# EasyEDA Pro project ProPrj_supercap v0.1_2026-02-15.epro, board 4loko
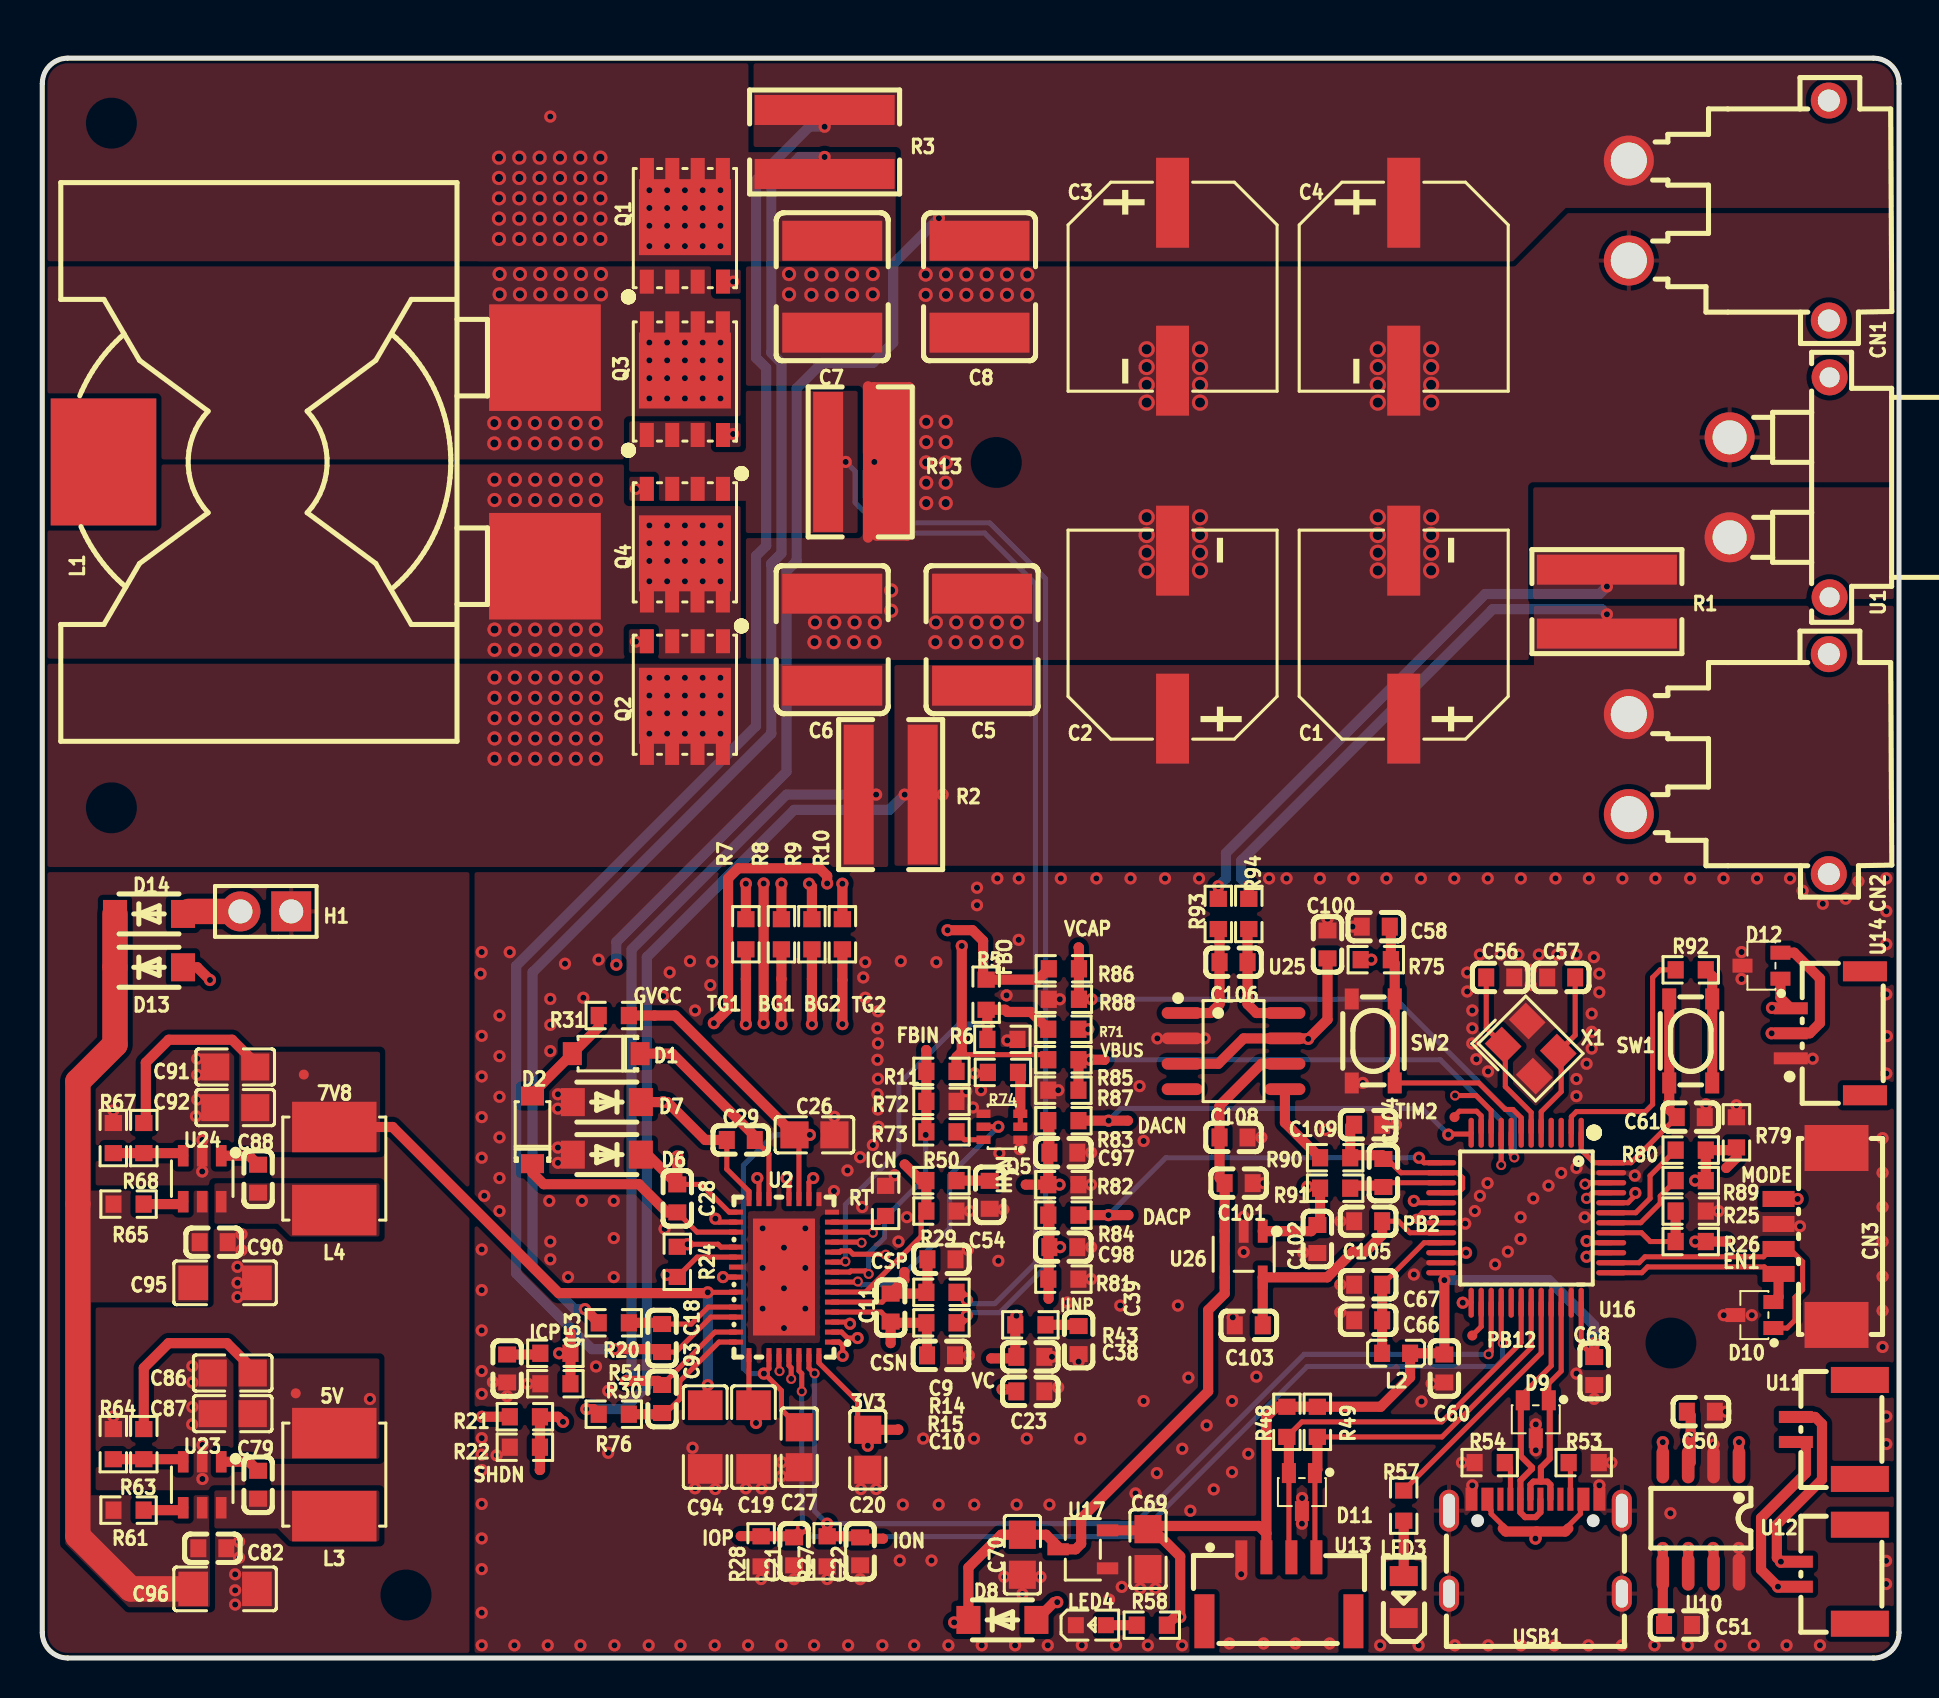
[diagram p5: board, top side]
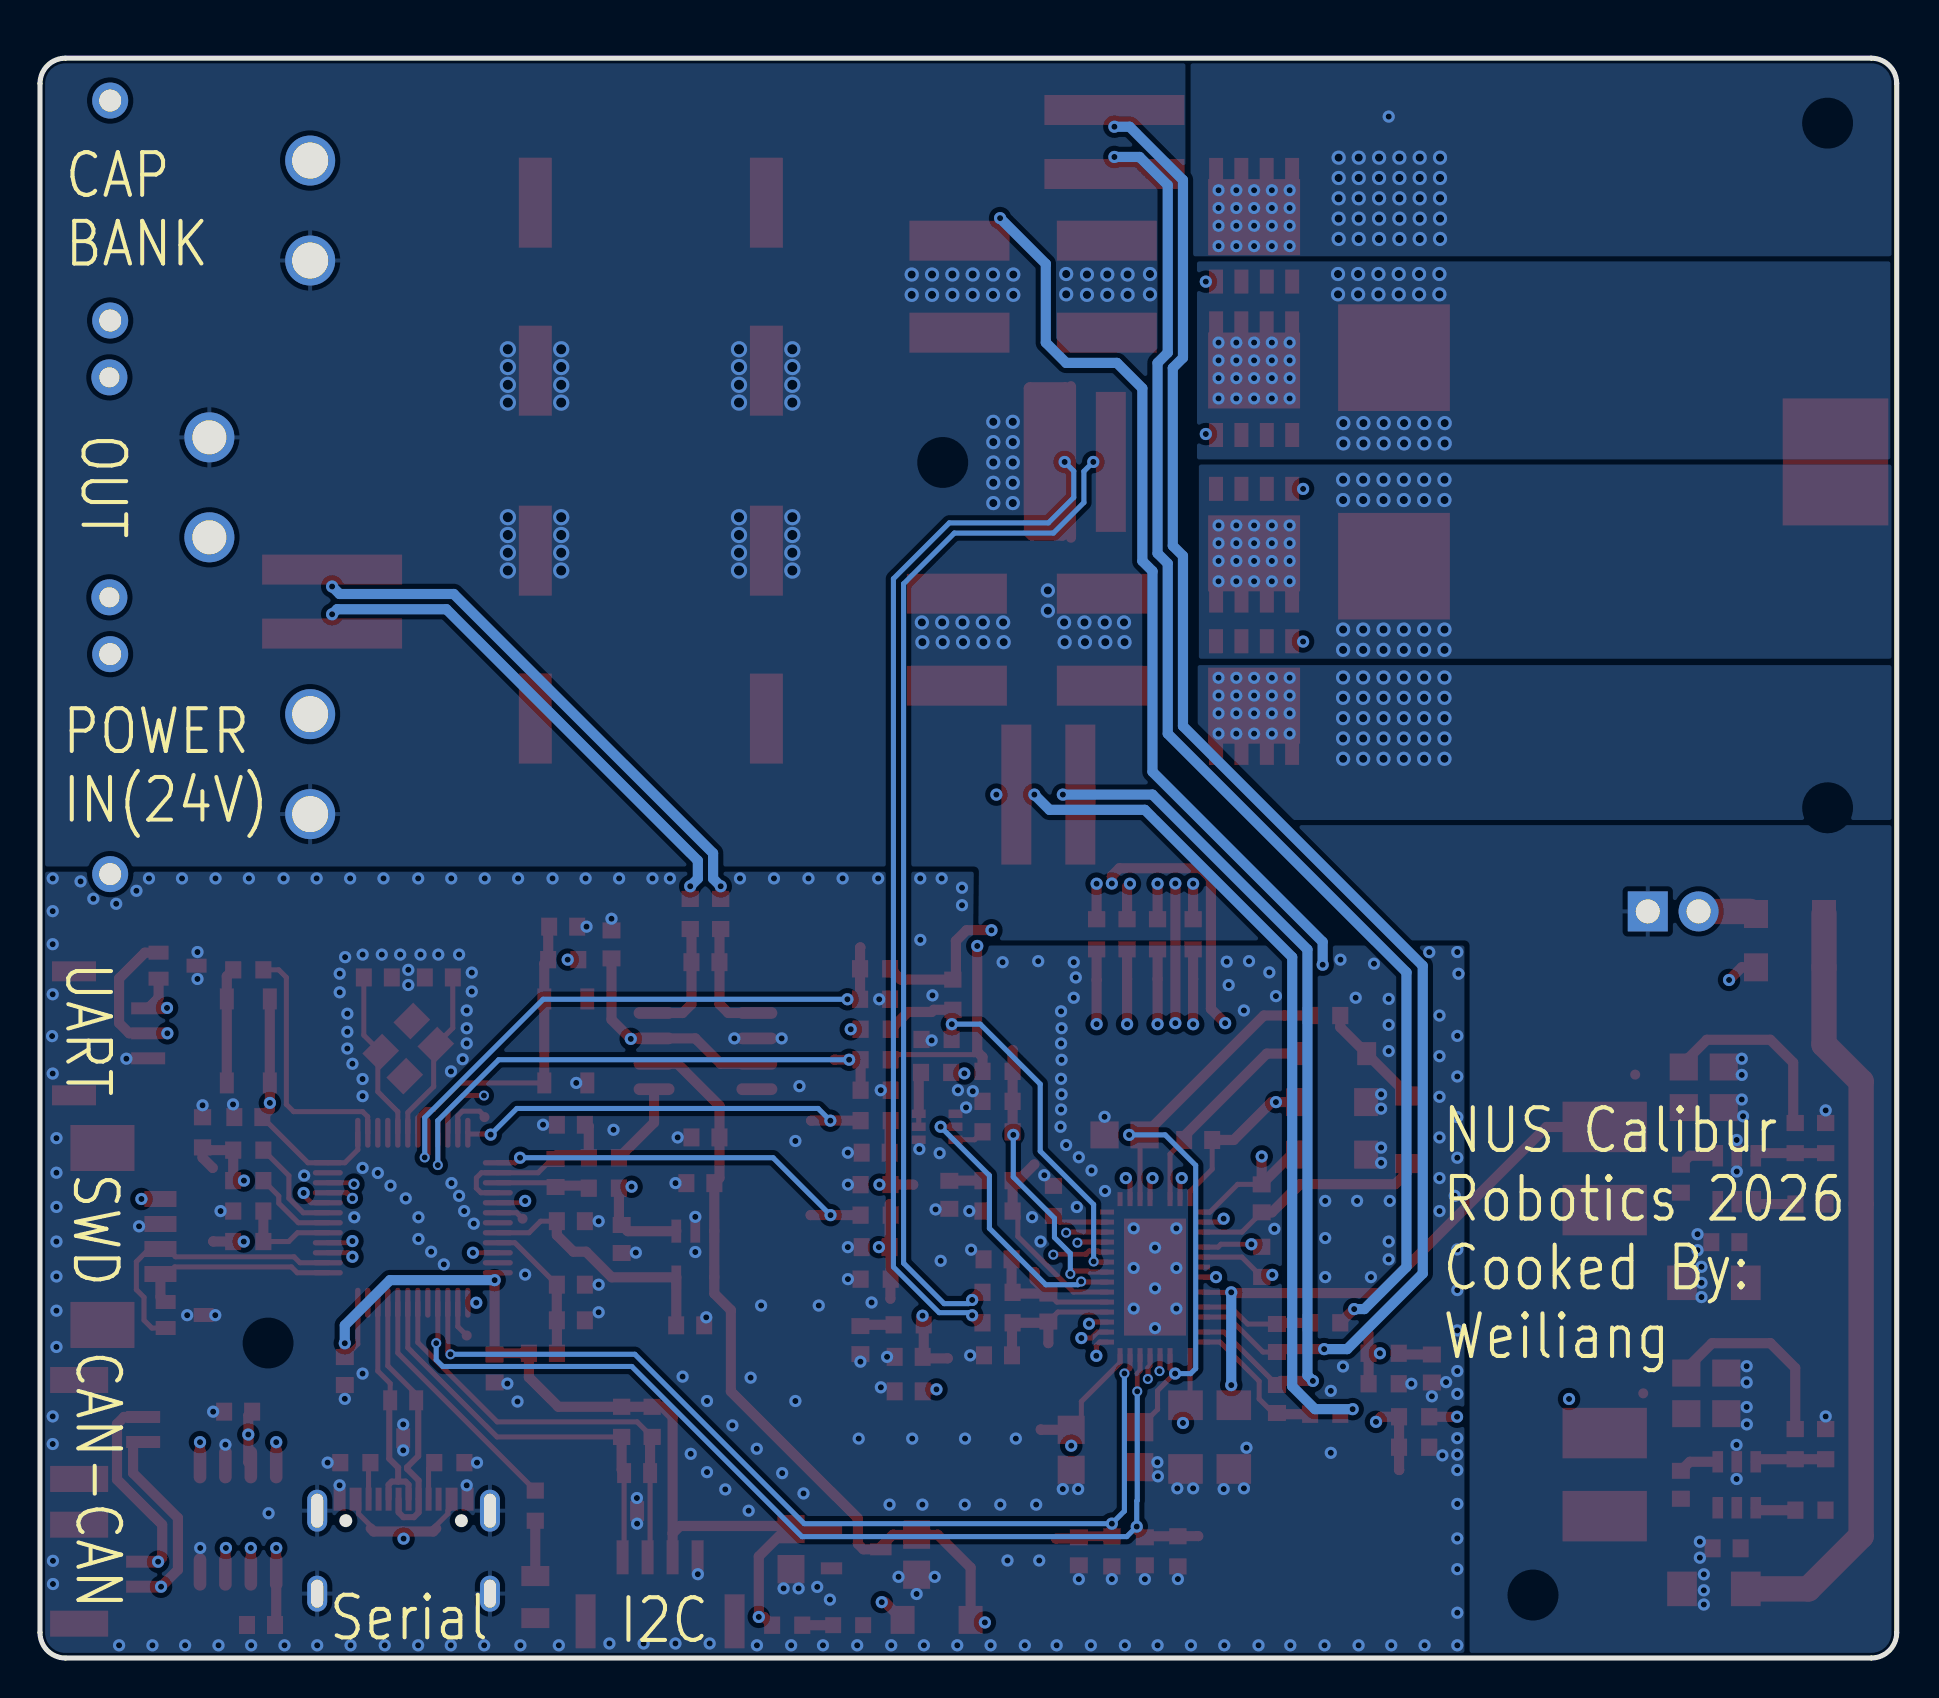
[diagram p6: board, bottom side, seen from below]

Outline 92.84 x 80.01 mm; copper layers: Top Layer, Inner1, Inner2, Bottom Layer. Coordinates in mm from the lower left corner of the outline.
Outline path: 0,78.74 0,1.27 arc(0.37,0.37) 1.27,0 91.57,0 arc(92.47,0.37) 92.84,1.27 92.84,78.74 arc(92.47,79.64) 91.57,80.01 1.27,80.01 arc(0.37,79.64) 0,78.74
Stack: Top Layer 0.035mm Outer layer thickness 1oz / Dielectric1 0.2104mm 7628 RC49% 8.6mil / Inner1 0.0152mm Inner layer thickness / Dielectric2 1.065mm 1.1mm H/HOZ Copper / Inner2 0.0152mm Inner layer thickness / Dielectric3 0.2104mm 7628 RC49% 8.6mil / Bottom Layer 0.035mm Outer layer thickness 1oz

## Design rules (mm)
template: Custom Config
spacing copperThickness1oz (default): track to track 0.102, other pairs 0.152 to 0.3
spacing copperThickness2oz: track to track 0.203, other pairs 0.152 to 0.3
track width copperThickness1oz (default): min 0.127, default 0.254, max 2.54
track width copperThickness2oz: min 0.203, default 0.254, max 2.54
differential pair differentialPair (default): width min 0.127, default 0.254, max 2.54; gap min 0.152, default 0.152
via viaSize (default): diameter min 0.5, default 0.61, max 10; hole min 0.3, default 0.305, max 6.3
net VBUSIN uses powerconnector
net GND uses ground
net CSNOUT uses powerconnector
net M4 uses directcopper
net AGND uses directcopper
net SW1 uses directcopper
net SW2 uses directcopper
net +5V uses directcopper
net $1N2593 uses directcopper
net $1N2600 uses directcopper
net $1N2588 uses directcopper
net MCSP uses directcopper
net $1N2584 uses directcopper
net VBUSOUT uses powerconnector
net CSNIN uses directcopper
net 7V8 uses directcopper
net $3N12371 uses directcopper
net $3N14015 uses directcopper
net VAUXIN uses directcopper

## Placement (name value [footprint] x y rotation side)
3V3  -  [Test-Point-0.5mm]  42.8 11.43 0 top
5V  -  [Test-Point-0.5mm]  12.67 13.24 270 top
7V8  -  [Test-Point-0.5mm]  13.08 29.18 270 top
BG1  -  [Test-Point-0.5mm]  36.96 33.96 0 top
BG2  -  [Test-Point-0.5mm]  38.48 33.96 0 top
C1  270uF  [CAP-SMD_BD10.0-L10.3-W10.3-LS11.6-FD]  68.07 51.18 90 top
C2  270uF  [CAP-SMD_BD10.0-L10.3-W10.3-LS11.6-FD]  56.51 51.18 90 top
C3  270uF  [CAP-SMD_BD10.0-L10.3-W10.3-LS11.6-FD]  56.51 68.58 270 top
C4  270uF  [CAP-SMD_BD10.0-L10.3-W10.3-LS11.6-FD]  68.07 68.58 270 top
C5  10uF  [CAP-SMD_L6.0-W5.0]  46.99 50.93 90 top
C6  10uF  [CAP-SMD_L6.0-W5.0]  39.5 50.93 90 top
C7  10uF  [CAP-SMD_L6.0-W5.0]  39.5 68.58 270 top
C8  10uF  [CAP-SMD_L6.0-W5.0]  46.86 68.58 270 top
C9  1nF  [C0603]  44.96 19.94 0 top
C10  1nF  [C0603]  44.94 15.14 180 top
C11  3.3nF  [C0603]  42.42 17.53 270 top
C18  470nF  [C0603]  30.99 16 270 top
C19  4.7uF  [C1206]  35.56 11.05 270 top
C20  4.7uF  [C0805]  41.28 10.41 90 top
C21  10nF  [C0603]  37.59 5.33 270 top
C22  10nF  [C0603]  40.89 5.33 270 top
C23  1uF  [C0603]  49.4 13.34 0 top
C26  4.7uF  [C0805]  38.61 26.16 180 top
C27  4.7uF  [C0805]  37.85 10.54 90 top
C28  220nF  [C0603]  31.75 22.99 270 top
C29  220nF  [C0603]  34.93 25.91 0 top
C38  220pF  [C0603]  49.4 15.06 0 top
C39  4.7nF  [C0603]  51.82 15.9 270 top
C50  100nF  [C0603]  82.93 12.32 180 top
C51  100nF  [C0603]  81.79 1.65 180 top
C53  10nF  [C0603]  23.24 14.48 270 top
C54  10nF  [C0603]  47.37 23.17 270 top
C56  10pF  [C0603]  72.9 34.04 0 top
C57  10pF  [C0603]  75.95 34.04 0 top
C58  100nF  [C0603]  66.68 36.58 0 top
C60  100nF  [C0603]  70.1 14.48 90 top
C61  100nF  [C0603]  82.42 27.05 180 top
C66  1uF  [C0603]  66.29 16.89 180 top
C67  100nF  [C0603]  66.29 18.67 0 top
C68  100nF  [C0603]  77.6 14.35 90 top
C69  4.7uF  [C0805]  55.29 5.44 90 top
C70  4.7uF  [C0805]  49.01 5.17 90 top
C79  100nF  [C0603]  10.79 8.66 90 top
C82  100nF  [C0603]  8.5 5.49 0 top
C86  4.7uF  [C0805]  9.52 14.25 0 top
C87  4.7uF  [C0805]  9.52 12.22 0 top
C88  100nF  [C0603]  10.79 23.97 90 top
C90  100nF  [C0603]  8.57 20.8 0 top
C91  4.7uF  [C0805]  9.65 29.56 0 top
C92  4.7uF  [C0805]  9.65 27.53 0 top
C93  470nF  [C0603]  30.99 12.95 90 top
C94  4.7uF  [C1206]  33.15 11.05 270 top
C95  4.7uF  [C1206]  9.14 18.76 0 top
C96  4.7uF  [C1206]  9.14 3.46 180 top
C97  10nF  [C0603]  51.05 25.27 0 top
C98  10nF  [C0603]  51.05 20.55 0 top
C100  100nF  [C0603]  64.26 35.69 90 top
C101  1uF  [C0603]  59.82 23.75 180 top
C102  100nF  [C0603]  63.75 20.96 270 top
C103  100nF  [C0603]  60.32 16.64 180 top
C104  220pF  [C0603]  67.06 24.26 270 top
C105  100nF  [C0603]  66.29 21.84 180 top
C106  220pF  [C0603]  59.56 34.8 0 top
C108  1uF  [C0603]  59.56 26.03 0 top
C109  220pF  [C0603]  66.29 26.67 0 top
CN1  XT30PW-M30.G.Y  [CONN-TH_XT30PW-M]  84.33 72.39 90 top
CN2  XT30PW-M30.G.Y  [CONN-TH_XT30PW-M]  84.33 44.7 90 top
CN3  532610471  [CONN-SMD_4P-P1.25_53261-0471]  88.26 21.08 90 top
CSN  -  [Test-Point-0.5mm]  42.42 15.75 0 top
CSP  -  [Test-Point-0.5mm]  43.1 19.3 0 top
D1  DSF1D  [SOD-123_L2.8-W1.8-LS3.7-RD]  28.19 30.23 180 top
D2  DSF1D  [SOD-123_L2.8-W1.8-LS3.7-RD]  24.51 26.42 90 top
D6  DSK110  [SOD-123_L2.8-W1.8-LS3.7-FD]  28.23 25.17 0 top
D7  DSK110  [SOD-123_L2.8-W1.8-LS3.7-FD]  28.23 27.8 0 top
D8  DSK110  [SOD-123_L2.8-W1.8-LS3.7-FD]  48.01 1.91 180 top
D9  TPD2E2U06DCKR  [SC-70-3_L2.0-W1.3-P0.65-LS2.1-BL]  74.68 11.94 180 top
D10  TPD2E2U06DCKR  [SC-70-3_L2.0-W1.3-P0.65-LS2.1-BL]  85.6 17.15 90 top
D11  TPD2E2U06DCKR  [SC-70-3_L2.0-W1.3-P0.65-LS2.1-BL]  62.98 8.3 180 top
D12  TPD2E2U06DCKR  [SC-70-3_L2.0-W1.3-P0.65-LS2.1-BL]  85.96 34.62 90 top
D13  DSK110  [SOD-123_L2.8-W1.8-LS3.7-FD]  5.33 34.54 180 top
D14  DSK110  [SOD-123_L2.8-W1.8-LS3.7-FD]  5.33 37.21 180 top
DACN  -  [Test-Point-0.5mm]  54.28 26.87 0 top
DACP  -  [Test-Point-0.5mm]  54.31 22.15 0 top
EN1  -  [Test-Point-0.5mm]  84.18 20.84 0 top
FBIN  -  [Test-Point-0.5mm]  44.2 30.4 0 top
FBO  -  [Test-Point-0.5mm]  48.26 32.31 90 top
GVCC  -  [Test-Point-0.5mm]  30.61 32.13 0 top
H1  PZ254V-11-02P  [HDR-TH_2P-P2.54-V-M]  11.18 37.34 180 top
ICN  -  [Test-Point-0.5mm]  43.12 24.68 0 top
ICP  -  [Test-Point-0.5mm]  26.42 16.26 0 top
IINN  -  [Test-Point-0.5mm]  49.17 23.67 0 top
IINP  -  [Test-Point-0.5mm]  50.31 17.97 0 top
ION  -  [Test-Point-0.5mm]  42.04 5.97 270 top
IOP  -  [Test-Point-0.5mm]  34.93 6.1 270 top
L1  6.8uH  [IND-SMD_3P-L27.9-W19.7-P10.43-LS27.9-BL-A]  14.1 59.82 90 top
L2  BLM18AG102SN1D  [L0603]  67.69 15.24 180 top
L3  22uH  [IND-SMD_L5.0-W5.0_LVS505040]  14.6 9.17 270 top
L4  22uH  [IND-SMD_L5.0-W5.0_LVS505040]  14.6 24.48 270 top
LED3  KT-0805B  [LED0805-R-RD]  68.07 3.05 90 top
LED4  KT-0603R  [LED0603-RD]  52.43 1.64 0 top
MODE  -  [Test-Point-0.5mm]  84.2 24.51 0 top
PB2  -  [Test-Point-0.5mm]  68.71 21.97 0 top
PB12  -  [Test-Point-0.5mm]  71.5 16.13 0 top
Q1  CJAC13TH06  [PDFN-8_L5.8-W4.9-P1.27-LS6.1-BL]  32.13 71.63 0 top
Q2  CJAC13TH06  [PDFN-8_L5.8-W4.9-P1.27-LS6.1-BL]  32.13 48.06 180 top
Q3  CJAC13TH06  [PDFN-8_L5.8-W4.9-P1.27-LS6.1-BL]  32.13 63.96 0 top
Q4  CJAC13TH06  [PDFN-8_L5.8-W4.9-P1.27-LS6.1-BL]  32.13 55.68 180 top
Q5  2N7002DW-7-F  [SOT-363_L2.0-W1.3-P0.65-LS2.1-TL]  47.98 26.57 180 top
R1  2mΩ  [R1225]  78.23 52.83 90 top
R2  2mΩ  [R1225]  42.42 43.18 0 top
R3  2mΩ  [R1225]  39.12 75.82 270 top
R5  137kΩ  [R0603]  47.19 33.17 270 top
R6  7.68kΩ  [R0603]  48.01 30.94 0 top
R7  1Ω  [R0603]  35.18 36.19 270 top
R8  1Ω  [R0603]  36.96 36.19 270 top
R9  1Ω  [R0603]  38.48 36.19 270 top
R10  1Ω  [R0603]  40 36.19 270 top
R11  137kΩ  [R0603]  44.96 29.34 180 top
R13  2mΩ  [R1225]  40.89 59.82 180 top
R14  10Ω  [R0603]  44.96 18.29 180 top
R15  10Ω  [R0603]  44.96 16.76 180 top
R20  10Ω  [R0603]  28.57 16.76 0 top
R21  665kΩ  [R0603]  24.13 12.06 0 top
R22  100kΩ  [R0603]  24.13 10.54 180 top
R24  100kΩ  [R0603]  31.75 19.81 90 top
R25  56kΩ  [R0603]  82.42 22.35 180 top
R26  56kΩ  [R0603]  82.42 20.83 0 top
R27  24.3kΩ  [R0603]  39.24 5.33 270 top
R28  24.3kΩ  [R0603]  35.94 5.33 270 top
R29  17.4kΩ  [R0603]  44.96 22.35 0 top
R30  17.4kΩ  [R0603]  25.65 13.72 180 top
R31  3.3Ω  [R0603]  28.57 32.13 180 top
R43  21kΩ  [R0603]  49.4 16.66 0 top
R48  7.68kΩ  [R0603]  62.23 11.81 270 top
R49  7.68kΩ  [R0603]  63.75 11.81 270 top
R50  200Ω  [R0603]  44.96 23.88 0 top
R51  200Ω  [R0603]  25.65 15.24 180 top
R53  5.1kΩ  [R0603]  77.07 9.77 180 top
R54  5.1kΩ  [R0603]  72.37 9.77 0 top
R57  5.1kΩ  [R0603]  68.07 7.62 90 top
R58  5.1kΩ  [R0603]  55.48 1.64 0 top
R61  665kΩ  [R0603]  4.31 7.39 180 top
R63  56kΩ  [R0603]  5.07 10.7 90 top
R64  10.7kΩ  [R0603]  3.55 10.7 270 top
R65  665kΩ  [R0603]  4.31 22.7 180 top
R67  10.7kΩ  [R0603]  3.55 26 270 top
R68  93.1kΩ  [R0603]  5.07 26 90 top
R71  17.4kΩ  [R0603]  51.05 31.44 0 top
R72  17.4kΩ  [R0603]  44.96 27.84 0 top
R73  10.7kΩ  [R0603]  44.96 26.31 180 top
R74  100kΩ  [R0603]  48.03 29.29 0 top
R75  10.7kΩ  [R0603]  66.68 34.92 180 top
R76  10Ω  [R0603]  28.57 12.19 0 top
R79  93.1kΩ  [R0603]  84.71 26.29 270 top
R80  56kΩ  [R0603]  82.42 25.4 0 top
R81  30.1kΩ  [R0603]  51.05 18.95 180 top
R82  30.1kΩ  [R0603]  51.05 23.67 180 top
R83  50kΩ  [R0603]  51.05 26.87 180 top
R84  50kΩ  [R0603]  51.05 22.15 0 top
R85  56kΩ  [R0603]  51.05 29.92 180 top
R86  56kΩ  [R0603]  51.08 34.47 180 top
R87  5.1kΩ  [R0603]  51.05 28.4 0 top
R88  5.1kΩ  [R0603]  51.08 32.94 0 top
R89  30.1kΩ  [R0603]  82.42 23.88 180 top
R90  200Ω  [R0603]  64.64 25.02 0 top
R91  200Ω  [R0603]  64.64 23.5 0 top
R92  200Ω  [R0603]  82.42 34.42 180 top
R93  1Ω  [R0603]  58.8 37.21 270 top
R94  1Ω  [R0603]  60.32 37.21 270 top
RT  294kΩ  [R0603]  42.16 22.86 90 top
SHDN  -  [Test-Point-0.5mm]  24.87 9.4 0 top
SW1  SKRPACE010  [KEY-SMD_4P-L4.2-W3.2-P2.20-LS4.6]  82.42 30.86 90 top
SW2  SKRPACE010  [KEY-SMD_4P-L4.2-W3.2-P2.20-LS4.6]  66.55 30.86 90 top
TG1  -  [Test-Point-0.5mm]  35.18 33.96 0 top
TG2  -  [Test-Point-0.5mm]  40 33.91 0 top
TIM2  -  [Test-Point-0.5mm]  70.61 27.05 0 top
U1  XT30PW-F20.G.Y  [CONN-TH_XT30PW-F-1]  86.87 58.55 90 top
U2  LT8708EUHG#TRPBF  [QFN-40_L8.0-W5.0-P0.50-TL-EP_ADI_UHG]  37.08 19.05 180 top
U10  ATA6560-GAQW-N  [SOP-8_L4.9-W3.9-P1.27-LS6.0-BL]  82.93 6.99 180 top
U11  SM02B-GHS-TB(LF)(SN)  [CONN-SMD_SM02B-GHS-TB-LF-SN]  89.28 11.43 90 top
U12  SM02B-GHS-TB(LF)(SN)  [CONN-SMD_SM02B-GHS-TB-LF-SN]  89.28 4.19 90 top
U13  SM04B-GHS-TB(LF)(SN)  [CONN-SMD_4P-P1.25_SM04B-GHS-TB-LF-SN]  61.83 3.44 0 top
U14  SM03B-GHS-TB(LF)(SN)  [CONN-TH_SM03B-GHS-TB-LF-SN]  89.28 31.24 90 top
U16  STM32G431CBT6  [LQFP-48_L7.0-W7.0-P0.50-LS9.0-BL]  74.2 22.02 180 top
U17  ME6216A33XG  [SOT-23-3_L2.9-W1.6-P1.90-LS2.8-BR]  52.03 5.44 0 top
U23  LGS5148  [SOT-23-6_L2.9-W1.6-P0.95-LS2.8-BL]  8 8.66 180 top
U24  LGS5148  [SOT-23-6_L2.9-W1.6-P0.95-LS2.8-BL]  8 23.97 180 top
U25  INA240A2DR  [SOIC-8_L4.9-W3.9-P1.27-LS6.0-BL]  59.56 30.35 270 top
U26  REF2033AIDDCR  [SOT-23-5_L3.0-W1.7-P0.95-LS2.8-BL]  60.07 20.19 180 top
USB1  TYPE-C16PIN  [USB-C-SMD_TYPE-C16PIN]  74.66 5.58 0 top
VBUS  -  [Test-Point-0.5mm]  53.11 29.92 0 top
VC  -  [Test-Point-0.5mm]  47.45 14.99 0 top
VCAP  -  [Test-Point-0.5mm]  51.82 35.54 0 top
X1  8MHz  [CRYSTAL-SMD_4P-L3.2-W2.5-BL]  74.42 30.48 315 top

## Footprints (pads in the part's own frame, mm; a bottom-side part is the same pattern mirrored in y, then rotated)
C0603
  rect 0.8x0.9 smd: 1(-0.7,0) 2(0.7,0)
C0805
  rect 1.41x1.35 smd: 1(-1,0) 2(1,0)
C1206
  rect 1.485x1.728 smd: 1(-1.593,0) 2(1.593,0)
CAP-SMD_BD10.0-L10.3-W10.3-LS11.6-FD
  rect 4.5x1.65 smd: 1(-4.2,0) 2(4.2,0)
CAP-SMD_L6.0-W5.0
  rect 2x5 smd: 1(-2.3,0) 2(2.3,0)
CONN-SMD_4P-P1.25_53261-0471
  rect 0.8x1.6 smd: 1(-1.875,1.45) 2(-0.625,1.45) 3(0.625,1.45) 4(1.875,1.45)
  rect 2.3x3.2 smd: 5(4.425,-1.45) 6(-4.425,-1.45)
CONN-SMD_4P-P1.25_SM04B-GHS-TB-LF-SN
  rect 0.6x1.7 smd: 1(-1.875,1.599) 2(-0.625,1.599) 3(0.625,1.599) 4(1.875,1.599)
  rect 1x2.7 smd: 5(3.724,-1.599) 6(-3.724,-1.599)
CONN-SMD_SM02B-GHS-TB-LF-SN
  rect 0.6x1.7 smd: 1(-0.625,1.6) 2(0.625,1.6)
  rect 1.3x2.9 smd: 3(2.475,-1.6) 4(-2.475,-1.6)
CONN-TH_SM03B-GHS-TB-LF-SN
  rect 0.6x1.7 smd: 1(-1.25,1.854) 2(0,1.854) 3(1.25,1.854)
  rect 1x2.2 smd: 4(3.1,-1.854) 5(-3.1,-1.854)
CONN-TH_XT30PW-F-1
  round 2.5 hole 1.7: 1(-2.5,2.5) 2(2.5,2.5)
  round 1.8 hole 1: 3(5.5,-2.5) 4(-5.5,-2.5)
CONN-TH_XT30PW-M
  round 2.5 hole 1.8: 1(-2.5,5) 2(2.5,5)
  round 1.8 hole 1.1: 3(5.5,-5) 4(-5.5,-5)
CRYSTAL-SMD_4P-L3.2-W2.5-BL
  rect 1.4x1.2 smd: 1(-1.1,-0.85) 2(1.1,-0.85) 3(1.1,0.85) 4(-1.1,0.85)
HDR-TH_2P-P2.54-V-M
  rect 2x2 hole 1.2: 1(-1.27,0)
  round 2 hole 1.2: 2(1.27,0)
IND-SMD_3P-L27.9-W19.7-P10.43-LS27.9-BL-A
  rect 5.33x5.59 smd: 1(-5.215,-11.037) 2(5.215,-11.037)
  rect 6.35x5.28 smd: 3(0,11.037)
IND-SMD_L5.0-W5.0_LVS505040
  rect 2.524x4.22 smd: 1(2.078,0) 2(-2.078,0)
KEY-SMD_4P-L4.2-W3.2-P2.20-LS4.6
  rect 1.05x0.7 smd: 1(-2.1,1.075) 2(2.1,1.075) 3(-2.1,-1.075) 4(2.1,-1.075)
L0603
  rect 0.8x0.864 smd: 1(-0.7,0) 2(0.7,0)
LED0603-RD
  rect 0.8x0.8 smd: 1(-0.749,0) 2(0.749,0)
LED0805-R-RD
  rect 1x1.399 smd: 1(1.05,0) 2(-1.05,0)
LQFP-48_L7.0-W7.0-P0.50-LS9.0-BL
  oval 0.27x1.5 smd: 1(-2.75,-4.25) 2(-2.25,-4.25) 3(-1.75,-4.25) 4(-1.25,-4.25) 5(-0.75,-4.25) 6(-0.25,-4.25) 7(0.25,-4.25) 8(0.75,-4.25) 9(1.25,-4.25) 10(1.75,-4.25) 11(2.25,-4.25) 12(2.75,-4.25) 25(2.75,4.25) 26(2.25,4.25) 27(1.75,4.25) 28(1.25,4.25) 29(0.75,4.25) 30(0.25,4.25) 31(-0.25,4.25) 32(-0.75,4.25) 33(-1.25,4.25) 34(-1.75,4.25) 35(-2.25,4.25) 36(-2.75,4.25)
  oval 1.5x0.27 smd: 13(4.25,-2.75) 14(4.25,-2.25) 15(4.25,-1.75) 16(4.25,-1.25) 17(4.25,-0.75) 18(4.25,-0.25) 19(4.25,0.25) 20(4.25,0.75) 21(4.25,1.25) 22(4.25,1.75) 23(4.25,2.25) 24(4.25,2.75) 37(-4.25,2.75) 38(-4.25,2.25) 39(-4.25,1.75) 40(-4.25,1.25) 41(-4.25,0.75) 42(-4.25,0.25) 43(-4.25,-0.25) 44(-4.25,-0.75) 45(-4.25,-1.25) 46(-4.25,-1.75) 47(-4.25,-2.25) 48(-4.25,-2.75)
PDFN-8_L5.8-W4.9-P1.27-LS6.1-BL
  rect 0.7x1.2 smd: 1(-1.905,-2.792) 2(-0.635,-2.792) 3(0.635,-2.792) 4(1.905,-2.792) 5(1.9,2.792) 6(0.64,2.792) 7(-0.63,2.792) 8(-1.9,2.792)
  rect 4.6x3.8 smd: 9(0,0.432)
QFN-40_L8.0-W5.0-P0.50-TL-EP_ADI_UHG
  rect 0.7x0.25 smd: 1(-2.4,3.25) 2(-2.4,2.75) 3(-2.4,2.25) 4(-2.4,1.75) 5(-2.4,1.25) 6(-2.4,0.75) 7(-2.4,0.25) 8(-2.4,-0.25) 9(-2.4,-0.75) 10(-2.4,-1.25) 11(-2.4,-1.75) 12(-2.4,-2.25) 13(-2.4,-2.75) 14(-2.4,-3.25) 22(2.4,-3.25) 23(2.4,-2.75) 24(2.4,-2.25) 25(2.4,-1.5) 26(2.4,-1) 27(2.4,-0.5) 28(2.4,0) 29(2.4,0.75) 30(2.4,1.5) 31(2.4,2) 32(2.4,2.75) 33(2.4,3.25)
  rect 0.25x0.7 smd: 15(-1.75,-3.9) 16(-1.25,-3.9) 17(-0.75,-3.9) 18(-0.25,-3.9) 19(0.75,-3.9) 20(1.25,-3.9) 21(1.75,-3.9) 34(1.75,3.9) 35(0.75,3.9) 36(0.25,3.9) 37(-0.25,3.9) 38(-0.75,3.9) 39(-1.25,3.9) 40(-1.75,3.9)
  rect 3.1x5.85 smd: 41(0,0)
R0603
  rect 0.806x0.864 smd: 1(-0.753,0) 2(0.753,0)
R1225
  rect 1.5x7 smd: 1(-1.6,0) 2(1.6,0)
SC-70-3_L2.0-W1.3-P0.65-LS2.1-BL
  rect 0.7x1 smd: 1(-0.65,-0.95) 2(0.65,-0.95) 3(0,0.95)
SOD-123_L2.8-W1.8-LS3.7-FD
  rect 1.2x1.4 smd: 1(-1.7,0) 2(1.7,0)
SOD-123_L2.8-W1.8-LS3.7-RD
  rect 0.95x1.15 smd: 1(-1.692,0) 2(1.692,0)
SOIC-8_L4.9-W3.9-P1.27-LS6.0-BL
  oval 0.588x2.045 smd: 1(-1.905,-2.57) 2(-0.635,-2.57) 3(0.635,-2.57) 4(1.905,-2.57) 5(1.905,2.57) 6(0.635,2.57) 7(-0.635,2.57) 8(-1.905,2.57)
SOP-8_L4.9-W3.9-P1.27-LS6.0-BL
  oval 0.63x1.865 smd: 1(-1.905,-2.683) 2(-0.635,-2.683) 3(0.635,-2.683) 4(1.905,-2.683) 5(1.905,2.683) 6(0.635,2.683) 7(-0.635,2.683) 8(-1.905,2.683)
SOT-23-3_L2.9-W1.6-P1.90-LS2.8-BR
  rect 1.07x0.6 smd: 1(1.235,-0.95) 2(1.235,0.95) 3(-1.235,0)
SOT-23-5_L3.0-W1.7-P0.95-LS2.8-BL
  rect 0.49x1.157 smd: 1(-0.95,-1.153) 2(0,-1.153) 3(0.95,-1.153)
  rect 0.49x1.175 smd: 4(0.95,1.153) 5(-0.95,1.153)
SOT-23-6_L2.9-W1.6-P0.95-LS2.8-BL
  rect 0.532x1.072 smd: 1(-0.95,-1.149) 2(0,-1.149) 3(0.95,-1.149) 4(0.95,1.149) 5(0,1.149) 6(-0.95,1.149)
SOT-363_L2.0-W1.3-P0.65-LS2.1-TL
  rect 0.7x0.42 smd: 1(-0.92,0.65) 2(-0.92,0) 3(-0.92,-0.65) 4(0.92,-0.65) 5(0.92,0) 6(0.92,0.65)
Test-Point-0.5mm
  round 0.5 smd: 1(0,0)
USB-C-SMD_TYPE-C16PIN
  oval 1x2.1 hole 0.6x1.7: 1(-4.32,1.788) 2(4.32,1.788)
  oval 1x1.8 hole 0.6x1.4: 3(-4.32,-2.362) 4(4.32,-2.362)
  rect 0.6x1.15 smd: A1B12(-3.2,2.362) A4B9(-2.4,2.362) B1A12(3.2,2.362) B4A9(2.4,2.362)
  rect 0.3x1.15 smd: A5(-1.25,2.362) A6(-0.25,2.362) A7(0.25,2.362) A8(1.25,2.362) B5(1.75,2.362) B6(0.75,2.362) B7(-0.75,2.362) B8(-1.75,2.362)

## Nets
As in the schematic.

Pads without a net: CN1 3 4; CN2 3 4; L1 3; U1 3 4; U11 3 4; U12 3 4; U13 5 6; U14 4 5; U16 3 4; U25 4; USB1 A8 B8

## Via types
v1: diameter 0.61, hole 0.305, Top Layer to Bottom Layer, 538 vias
v2: diameter 0.711, hole 0.406, Top Layer to Bottom Layer, 160 vias
v3: diameter 0.813, hole 0.508, Top Layer to Bottom Layer, 32 vias
v4: diameter 0.5, hole 0.299, Top Layer to Bottom Layer, 15 vias
v5: diameter 0.559, hole 0.305, Top Layer to Bottom Layer, 2 vias

## Routing (per net, layer and track width the routed paths; a pad name or vN(x,y) marks a point on that pad's centre or on a via; arc(x,y) is an arc through that point)
1V65: length 23.4
  Top Layer w0.508: U26.1 63.45,21.35 C102.1 63.89,21.79 R91.1 ; C100.1 64.26,31.93 v1(63.3,30.96) 63.27,30.99 U25.7 60.07,30.99 58.8,29.72 U25.3
  Inner2 w0.508: v1(63.3,30.96) 63.3,23.61 v1(63.26,23.57)
3V3: length 43
  Top Layer w0.254: U2.40 38.83,14.76 40.77,12.83 40.77,11.92 C20.2 ; R24.1 32.74,20.05 U2.26
  Top Layer w0.508: 3V3.1 42.78,11.41 C20.2 v1(41.28,10.62) ; R24.1 31.65,19.16 v1(31.22,19.16)
  Inner2 w0.254: v1(41.28,10.62) 40.72,11.18 38.1,11.18 34.54,14.73 33.27,14.73 29.72,11.18 25.53,11.18 25.15,11.56 25.15,17.15 26.29,18.29 30.35,18.29 v1(31.22,19.16)
3V3D: length 193.4
  Top Layer w0.254: C61.2 79.44,24.77 U16.48 77.59,24.77 76.95,25.42 U16.1 ; U16.24 70.1,19.11 v1(70.1,18.9) ; C68.2 76.95,15.7 U16.36
  Top Layer w0.508: U13.2 61.21,6.23 ; 61.21,6.23 61.21,12.06 61.71,12.56 R48.1 R49.1 66.92,12.56 68.39,14.03 L2.1 70.04,15.24 C60.2 v1(70.1,18.9) ; 61.21,6.23 60.83,6.6 55.45,6.6 C69.2 ; 81.35,27.76 SW1.2 ; v1(81.34,27.76) 81.34,27.43 C61.2 ; v1(77.6,15.74) C68.2 ; v1(87.77,22.96) CN3.4 ; C69.2 55.23,6.39 U17.2 ; C69.2 55.53,6.44 56.9,5.08 v1(56.9,2.05) 56.64,2.05 R58.2 ; v1(66.45,34.92) R75.2
  Inner2 w0.254: v1(66.45,34.92) 48.13,34.92 46.62,33.41 v1(46.62,29.23)
  Inner2 w0.508: 81.29,36.7 81.34,36.65 v1(81.34,27.76) ; 81.29,36.7 89.53,36.7 90.93,35.31 90.93,22.91 ; 81.29,36.7 68.23,36.7 v1(66.45,34.92) ; 90.93,22.91 90.93,3.18 89.3,1.55 57.4,1.55 v1(56.9,2.05) ; 90.93,22.91 90.89,22.96 v1(87.77,22.96)
  Bottom Layer w0.508: v1(77.6,15.74) 77.6,16.64 75.34,18.9 v1(70.1,18.9)
3V3REF: length 13.1
  Top Layer w0.254: C105.1 67.81,21.84 68.38,21.27 U16.20
  Top Layer w0.508: C103.1 61.02,16.64 U26.5 64.25,19.04 65.53,20.32 66.16,20.32 66.99,21.15 C105.1
7V8: length 38.9
  Top Layer w0.254: C94.1 33.15,13.52 v1(33.27,13.65) ; v1(33.27,18.29) 34.67,18.29 U2.29
  Top Layer w0.508: C91.2 10.65,29.77 9.49,30.92 6.32,30.92 5.18,29.78 5.18,26.86 R68.2 ; L4.2 17.51,26.56 25.82,18.25 33.24,18.25 v1(33.27,18.29)
  Bottom Layer w0.508: v1(33.27,18.29) v1(33.27,13.65)
+5V: length 145.8
  Top Layer w0.508: 50.79,5.56 50.19,6.17 C70.2 47.95,6.17 46.31,4.52 D8.2 46.18,1.78 v1(45.59,1.78) ; C50.2 82.42,12.13 v1(82.42,11.18) 82.42,9.79 U10.3 ; U17.3 51.66,5.44 51.94,5.72 51.94,6.99 58.29,13.34 58.29,17.4 59.12,18.23 U26.4 U26.3 59.12,23.75 58.86,24 C108.1 58.86,27.62 60.96,29.72 U25.6 ; C86.2 10.52,14.46 9.23,15.75 6.31,15.75 5.07,14.51 R63.2
  Inner2 w0.508: v1(82.42,11.18) 82.42,8 83.44,6.99 86.36,6.99 88.01,5.33 88.01,3.3 87.5,2.79 82.3,2.79 80.01,5.08 54.23,5.08 50.93,1.78 v1(45.59,1.78) 23.5,1.78 21.08,4.19 21.08,10.03 18.16,12.95 v1(16.38,12.95)
AGND:
  vias: v1(21.91,34.22) v1(21.97,35.31) v1(21.97,31.11) v1(21.97,29.08) v1(21.97,27.05) v1(21.97,25.02) v1(21.97,20.43) v1(21.97,18.4) v1(21.97,16.38) v1(21.97,14.35) v1(21.97,13.21) v1(21.97,11) v1(21.97,10.17) v1(21.97,9.4) v1(21.97,7.71) v1(21.97,5.98) v1(21.97,4.44) v1(21.97,2.26) v1(21.97,0.63) v1(22.1,23.11) v1(22.53,13.8) v1(22.72,10.13) v1(22.86,32.13) v1(22.86,30.1) v1(22.86,28.07) v1(22.86,26.03) v1(22.86,24) v1(22.86,22.35) v1(23.24,13.09) v1(23.37,35.3) v1(23.61,0.63) v1(24.27,13.72) v1(25.35,22.86) v1(25.27,0.63) v1(25.4,32.96) v1(25.4,31.66) v1(25.4,30.35) v1(25.4,20.83) v1(25.4,19.94) v1(25.78,28.19) v1(25.78,27.47) v1(25.78,25.53) v1(25.78,24.76) v1(26.14,34.72) v1(26.29,19.05) v1(26.91,0.63) v1(26.98,22.86) v1(27.05,33.02) v1(27.69,14.58) v1(27.81,34.92) v1(28.3,13.36) v1(28.3,10.26) v1(28.57,22.86) v1(28.57,21) v1(28.57,19.05) v1(28.61,0.63) v1(30.32,0.63) v1(31.04,33.1) v1(31.12,21.46) v1(31.37,34.29) v1(31.91,0.63) v1(32.38,34.85) v1(32.51,10.52) v1(32.64,32.39) v1(32.64,8.49) v1(33.4,33.66) v1(33.5,34.82) v1(33.62,0.63) v1(33.65,8.45) v1(35.18,8.49) v1(35.29,0.63) v1(35.94,3.95) v1(36.02,21.49) v1(36.02,19.51) v1(36.02,17.47) v1(35.97,8.49) v1(36.94,9.09) v1(36.97,9.79) v1(36.96,0.63) v1(37.08,20.52) v1(37.08,18.49) v1(37.08,16.5) v1(37.59,3.94) v1(38.15,21.49) v1(38.15,19.51) v1(38.15,17.47) v1(38.59,0.63) v1(39.24,3.95) v1(39.61,27.07) v1(39.58,23.36) v1(40.26,24.38) v1(40.29,0.63) v1(40.89,25.04) v1(40.93,8.45) v1(40.89,3.94) v1(41.05,34.04) v1(41,22.56) v1(41.15,34.8) v1(41.15,33.02) v1(41.53,25.65) v1(41.69,8.45) v1(41.78,32.34) v1(41.76,31.5) v1(41.78,30.73) v1(41.76,29.92) v1(41.78,28.97) v1(41.76,28.19) v1(41.78,27.43) v1(41.81,26.57) v1(42,0.63) v1(42.62,24.14) v1(42.81,20.83) v1(42.93,34.85) v1(42.88,4.88) v1(43.03,7.67) v1(43.23,22.05) v1(43.59,0.63) v1(44.04,10.97) v1(44.46,4.88) v1(44.7,34.8) v1(44.82,7.67) v1(45.31,0.63) v1(46.2,28.35) v1(46.28,20.42) v1(46.33,15.13) v1(46.37,22.35) v1(46.53,27.53) v1(46.58,10.97) v1(46.6,7.67) v1(46.74,38.52) v1(46.74,37.65) v1(46.94,28.4) v1(46.97,0.63) v1(47.75,38.99) v1(47.8,19.86) v1(47.85,25.25) v1(48.06,22.44) v1(48.1,4.06) v1(48.21,33.14) v1(48.25,30.89) v1(48.64,0.63) v1(48.72,7.67) v1(48.82,38.99) v1(48.82,35.92) v1(48.87,25.45) v1(49.01,3.2) v1(49.22,10.97) v1(49.91,4.06) v1(50.28,0.63) v1(50.36,7.67) v1(50.48,15.06) v1(50.8,28.4) v1(50.79,13.54) v1(50.93,38.99) v1(50.88,32.94) v1(51.26,17.78) v1(51.82,14.82) v1(51.9,10.97) v1(51.98,0.63) v1(52.44,25.27) v1(52.44,23.67) v1(52.44,20.55) v1(52.44,18.95) v1(52.71,38.99) v1(53.34,2.92) v1(53.69,0.63) v1(53.9,17.63) v1(53.97,3.56) v1(54.41,38.99) v1(54.66,8.23) v1(54.86,28.6) v1(54.91,3.48) v1(55.07,25.86) v1(55.07,12.85) v1(55.28,0.63) v1(55.73,9.25) v1(55.66,3.48) v1(55.75,30.99) v1(56.14,38.99) v1(56.78,17.63) v1(57,10.47) v1(56.99,0.63) v1(57.31,14.02) v1(57.4,7.37) v1(57.84,38.99) v1(58.12,30.99) v1(58.22,11.63) v1(58.57,8.43) v1(59.35,0.73) v1(59.53,17.04) v1(59.49,12.85) v1(59.49,9.3) v1(59.94,4.19) v1(60.07,22.06) v1(60.07,20.3) v1(60.3,10.21) v1(60.71,14.07) v1(60.95,26.03) v1(61.06,23.75) v1(61.06,0.73) v1(61.34,38.99) v1(62.21,38.99) v1(62.66,0.73) v1(63.04,20.27) v1(62.99,8) v1(62.98,6.72) v1(63.88,38.99) v1(64.16,26.42) v1(64.26,36.97) v1(64.37,0.73) v1(64.9,21.84) v1(64.9,18.67) v1(64.9,17.29) v1(65.51,36.58) v1(65.56,38.99) v1(66.02,28.76) v1(66.9,0.63) v1(67.21,38.99) v1(67.68,26.67) v1(68.58,19.18) v1(68.82,0.63) v1(68.93,38.99) v1(68.96,12.83) v1(69.47,13.72) v1(70.6,38.99) v1(70.63,0.63) v1(70.99,9.77) v1(71.15,21.72) v1(71.25,34.28) v1(71.25,33.33) v1(71.5,32.39) v1(71.5,31.5) v1(71.5,30.73) v1(71.5,8.64) v1(71.63,22.35) v1(71.7,29.95) v1(71.88,35.18) v1(71.88,23.11) v1(72.27,38.99) v1(72.29,29.34) v1(72.26,23.75) v1(72.3,0.63) v1(72.64,19.69) v1(72.92,35.18) v1(73.28,20.32) v1(73.81,35.18) v1(73.93,38.99) v1(73.91,22.04) v1(73.91,20.96) v1(73.93,0.63) v1(74.42,34.42) v1(74.42,33.66) v1(74.55,22.99) v1(74.68,11.68) v1(74.68,10.39) v1(74.83,35.18) v1(75.31,23.62) v1(75.6,0.63) v1(75.66,38.99) v1(75.75,35.18) v1(75.95,24.26) v1(76.7,35.18) v1(76.71,28.96) v1(76.71,28.1) v1(76.71,24.51) v1(76.71,14.22) v1(77.12,22.04) v1(77.22,29.72) v1(77.33,38.99) v1(77.31,0.63) v1(77.47,32.22) v1(77.47,31.32) v1(77.47,30.48) v1(77.58,35.05) v1(77.6,12.96) v1(77.85,34.22) v1(77.85,33.29) v1(77.86,8.64) v1(78.46,9.77) v1(79.01,38.99) v1(78.98,0.63) v1(79.63,24.13) v1(80.61,0.63) v1(80.66,38.99) v1(81.41,7.24) v1(82.28,0.63) v1(82.39,38.99) v1(83.19,27.69) v1(83.57,10.67) v1(83.81,22.35) v1(83.91,0.63) v1(84.06,38.99) v1(84.07,17.15) v1(84.18,12.32) v1(84.71,27.64) v1(84.83,5.5) v1(84.96,35.31) v1(84.96,33.96) v1(85.48,17.15) v1(85.58,0.63) v1(85.74,38.99) v1(87.22,0.63) v1(87.39,38.99) v1(87.88,21.59) v1(88.02,38.37) v1(88.52,29.97) v1(88.88,0.63) v1(89.03,37.72) v1(90.17,37.97) v1(90.81,38.84) v1(92.01,26) v1(92.01,24.27) v1(92.01,22.56) v1(92.01,20.83) v1(92.01,19.08) v1(92.01,17.37) v1(92.01,15.56) v1(92.2,38.99) v1(92.2,37.35) v1(92.2,35.7) v1(92.2,33.19) v1(92.23,31.1) v1(92.2,29.23) v1(92.2,12.08) v1(92.2,10.7) v1(92.19,4.86) v1(92.19,3.7)
GND: length 13.9
  Inner1 w0.508: 43.89,35.86 29.97,35.86
  vias: v1(3.55,27.39) v1(3.55,12.08) v1(7.5,14.59) v1(7.5,13.78) v1(7.5,12.55) v1(7.49,11.68) v1(7.75,29.97) v1(7.75,29.16) v1(7.75,27.93) v1(7.68,27.09) v1(8,25.91) v1(8,24.33) v1(8.01,10.66) v1(8,8.95) v1(9.64,4.19) v1(9.64,3.39) v1(9.64,2.67) v1(9.76,19.56) v1(9.76,18.76) v1(9.76,18.05) v1(9.84,5.82) v1(9.84,5.02) v1(9.96,21.2) v1(9.96,20.4) v2(37.34,69.22) v2(37.34,68.2) v2(38.46,69.19) v2(38.46,68.17) v2(38.64,51.79) v2(38.61,50.8) v2(39.47,69.19) v2(39.47,68.17) v2(39.6,51.79) v2(39.57,50.8) v2(40.49,69.19) v2(40.49,68.17) v2(40.61,51.79) v2(40.59,50.8) v2(41.53,69.22) v2(41.53,68.2) v2(41.63,51.79) v2(41.6,50.8) v2(42.44,53.39) v2(42.44,52.38) v2(44.17,69.19) v2(44.17,68.17) v2(44.2,61.82) v2(44.2,60.81) v2(44.2,59.79) v2(44.2,58.78) v2(44.2,57.76) v2(44.68,51.79) v2(44.65,50.8) v2(45.19,69.19) v2(45.19,68.17) v2(45.17,61.82) v2(45.17,60.81) v2(45.17,59.79) v2(45.17,58.78) v2(45.17,57.76) v2(45.69,51.79) v2(45.67,50.8) v2(46.2,69.19) v2(46.2,68.17) v2(46.71,51.79) v2(46.68,50.8) v2(47.22,69.19) v2(47.22,68.17) v2(47.73,51.79) v2(47.7,50.8) v2(48.23,69.19) v2(48.23,68.17) v2(48.74,51.79) v2(48.72,50.8) v2(49.25,69.19) v2(49.25,68.17) v3(55.22,65.45) v3(55.22,64.56) v3(55.22,63.67) v3(55.22,62.78) v3(55.22,57.05) v3(55.22,56.16) v3(55.22,55.27) v3(55.22,54.39) v3(57.89,65.45) v3(57.89,64.56) v3(57.89,63.67) v3(57.89,62.78) v3(57.89,57.05) v3(57.89,56.16) v3(57.89,55.27) v3(57.89,54.39) v3(66.78,65.45) v3(66.78,64.56) v3(66.78,63.67) v3(66.78,62.78) v3(66.78,57.05) v3(66.78,56.16) v3(66.78,55.27) v3(66.78,54.39) v3(69.44,65.45) v3(69.44,64.56) v3(69.44,63.67) v3(69.44,62.78) v3(69.44,57.05) v3(69.44,56.16) v3(69.44,55.27) v3(69.44,54.39)
VBUSIN: length 169.3
  Top Layer w0.254: R85.2 50.24,29.92 49.99,30.17 46.12,30.17 45.97,30.32 ; U2.34 35.33,12.87 C19.1
  Top Layer w0.508: v1(60.32,38.6) R94.1 ; D13.1 7.75,34.54 v1(8.38,33.91) ; v1(27.2,12.45) 27.57,12.45 R76.1 ; v1(45.97,35.61) 45.97,30.32 45.71,30.06 R11.1 ; v1(21.98,12.06) R21.1 ; v1(35.69,11.75) 35.69,12.51 C19.1
  Inner2 w0.508: 20.95,32.26 20.95,13.09 v1(21.98,12.06) 24.78,9.27 33.2,9.27 v1(35.69,11.75) ; 20.95,32.26 21.01,32.26 22.61,33.86 29.72,33.86 31.5,35.64 45.95,35.64 45.97,35.61 46.13,35.76 46.13,36.88 45.02,37.99 v1(45.02,43.18) ; 20.95,32.26 19.3,33.91 v1(8.38,33.91)
  Bottom Layer w0.508: v1(60.32,38.6) 59.94,38.98 59.94,39.88 72.52,52.45 77.98,52.45 v1(78.23,52.2) ; v1(27.2,12.45) 29.08,12.45 30.23,13.59 30.23,35.05 37.59,42.42 42.36,42.42 v1(43.12,43.18)
VBUSMCU: length 28.5
  Top Layer w0.254: v4(72.95,24.65) U16.9
  Top Layer w0.508: R87.2 R85.1 v1(52.38,29.92) 53.11,29.92 VBUS.1
  Bottom Layer w0.254: v4(72.95,24.65) 72.95,26.88 69.9,29.92 v1(52.38,29.92)
VBUSOUT: length 27
  Top Layer w0.508: v1(58.8,38.6) R93.1
  Bottom Layer w0.508: v1(58.8,38.6) 59.18,38.98 59.18,40.25 72.15,53.21 77.86,53.21 v1(78.23,53.59)
VDDA: length 7.3
  Top Layer w0.254: C67.2 69.09,20.77 U16.21
  Top Layer w0.508: C67.2 C66.1 66.99,16.89 L2.2
BG1: length 19.3
  Top Layer w0.254: v1(38.54,24) 38.33,23.79 U2.16
  Top Layer w0.508: R8.2 BG1.1 v1(36.96,31.7)
  Inner1 w0.508: v1(36.96,31.7) 36.96,32.39 37.72,33.15 39.88,33.15 40.89,32.13 40.89,26.35 v1(38.54,24)
BG2: length 13.1
  Top Layer w0.254: U2.18 37.33,23.88 v1(37.21,24)
  Top Layer w0.508: v1(38.48,31.7) BG2.1 R9.2
  Inner1 w0.508: v1(38.48,31.7) 38.48,30.48 37.21,29.21 v1(37.21,24)
CANHI: length 15.4
  Top Layer w0.508: U11.2 88.63,12.06 88.99,11.7 88.99,8.93 86.73,6.67 86.73,5.02 v1(86.93,4.82) U12.2 ; v1(83.54,5.5) 83.57,5.48 U10.7
  Inner2 w0.508: v1(83.54,5.5) 83.54,5.36 84.46,4.44 86.56,4.44 v1(86.93,4.82)
CANLO: length 16.3
  Top Layer w0.508: U10.6 v1(82.3,5.5) ; U12.1 v1(86.78,3.57) 85.94,4.41 85.94,7 88.18,9.25 88.18,10.61 87.98,10.81 U11.1
  Inner2 w0.508: v1(86.78,3.57) 86.67,3.68 84.12,3.68 v1(82.3,5.5)
CANSILENCE: length 33
  Top Layer w0.254: U16.44 79.28,22.77 79.65,23.14 v1(79.65,23.26)
  Top Layer w0.508: v1(81.03,5.5) U10.5 81.03,1.71 C51.2
  Inner2 w0.254: v1(81.03,5.5) 80.42,6.11 80.42,10.47 78.99,11.89 78.99,16.26 84.46,21.72 84.46,24.38 83.95,24.89 82.83,24.89 81.2,23.26 v1(79.65,23.26)
CLKOUTMCU: length 44.6
  Top Layer w0.254: v1(40.02,15.11) 40.02,15.63 39.85,15.8 U2.1 ; U16.39 77.42,20.27 v1(77.22,20.07)
  Inner2 w0.254: v1(40.02,15.11) 40.02,13.45 40.64,12.83 52.4,12.83 55.32,15.75 70.61,15.75 74.93,20.07 v1(77.22,20.07)
CSN: length 7.7
  Top Layer w0.254: U2.4 41.94,17.3 C11.2
  Top Layer w0.508: C10.2 44.24,16.73 R15.2 42.48,16.76 C11.2 CSN.1
CSNIN: length 43.8
  Top Layer w0.254: C93.2 33.63,16.3 U2.32
  Top Layer w0.508: C93.2 30.78,13.86 v1(29.19,13.86)
  Bottom Layer w0.508: v1(41.69,43.18) 37.21,43.18 29.46,35.43 29.46,14.13 v1(29.19,13.86)
  vias: v1(30.35,49.02) v1(30.35,48.13) v1(30.35,47.24) v1(30.35,46.23) v1(31.24,49.02) v1(31.24,48.13) v1(31.24,47.24) v1(31.24,46.23) v1(32.13,49.02) v1(32.13,48.13) v1(32.13,47.24) v1(32.13,46.23) v1(33.02,49.02) v1(33.02,48.13) v1(33.02,47.24) v1(33.02,46.23) v1(33.91,49.02) v1(33.91,48.13) v1(33.91,47.24) v1(33.91,46.23) v2(22.61,49.04) v2(22.61,48.02) v2(22.61,47) v2(22.61,45.99) v2(22.61,44.97) v2(23.63,49.04) v2(23.63,48.02) v2(23.63,47) v2(23.63,45.99) v2(23.63,44.97) v2(24.64,49.04) v2(24.64,48.02) v2(24.64,47) v2(24.64,45.99) v2(24.64,44.97) v2(25.66,49.04) v2(25.66,48.02) v2(25.66,47) v2(25.66,45.99) v2(25.66,44.97) v2(26.68,49.04) v2(26.68,48.02) v2(26.68,47) v2(26.68,45.99) v2(26.68,44.97) v2(27.68,49.04) v2(27.68,48.02) v2(27.68,47) v2(27.68,45.99) v2(27.68,44.97)
CSNOUT: length 148.1
  Top Layer w0.254: C18.2 31.69,15.3 33.43,17.05 U2.31
  Top Layer w0.508: C18.2 30.84,15.45 v1(28.63,15.45) ; v1(45.26,36.4) 46.51,36.4 47.04,35.86 47.04,34.08 R5.1 49.78,33.93 R86.2
  Inner2 w0.508: v1(45.26,36.4) 45.21,36.45 30.48,36.45 v1(28.7,34.67)
  Bottom Layer w0.508: v1(28.63,15.45) 27.48,15.45 23.7,19.23 23.7,34.62 35.69,46.61 35.69,55.12 36.19,55.63 36.19,64.52 35.69,65.02 35.69,73.91 38.35,76.58 v1(39.12,76.58) ; v1(28.7,34.67) 28.7,35.81 37.21,44.32 37.21,54.36 37.72,54.86 37.72,63.5 38.99,64.77 41.53,64.77 42.54,65.79 42.54,69.72 v1(44.83,72.01)
CSP: length 8
  Top Layer w0.254: U2.5 41.99,17.8 C11.1
  Top Layer w0.508: CSP.1 43.1,18.91 C11.1 44.14,18.23 R14.2 44.26,18.34 C9.1
CSPIN: length 7.4
  Top Layer w0.254: U2.33 33.83,15.8 31.88,13.84 31.88,12.95 31.18,12.25 C93.1
  Top Layer w0.508: R76.2 30.93,12.19 C93.1
CSPOUT: length 5.7
  Top Layer w0.254: U2.30 33.3,17.55 32.45,16.7 C18.1
  Top Layer w0.508: C18.1 30.93,16.76 R20.2
DACINN: length 21.4
  Top Layer w0.254: U16.12 71.45,26.26 71.39,26.2 70.33,26.2 v1(70.3,26.18)
  Top Layer w0.508: DACN.1 v1(53.32,26.87) R83.1
  Bottom Layer w0.254: v1(53.32,26.87) 53.93,27.48 69,27.48 v1(70.3,26.18)
DACINP: length 20.4
  Top Layer w0.254: U16.13 69.08,24.77 v1(68.83,25.02)
  Top Layer w0.508: R84.2 v1(53.31,22.15) DACP.1
  Bottom Layer w0.254: v1(53.31,22.15) 56.18,25.02 v1(68.83,25.02)
DIRMCU: length 37.7
  Top Layer w0.254: U16.17 68.67,22.77 v1(68.58,22.86) ; v4(40.78,18.83) 40.75,18.8 U2.7 ; Q5.5 v1(47.8,26.57)
  Inner2 w0.254: v1(68.58,22.86) 56.84,22.86 53.57,26.14 48.24,26.14 v1(47.8,26.57)
  Bottom Layer w0.254: v1(47.8,26.57) 45.36,24.13 45.36,21.49 42.54,18.67 40.94,18.67 v4(40.78,18.83)
FBIN: length 14.3
  Top Layer w0.254: U2.8 40.37,19.3 40.43,19.36 41.17,19.36 v4(41.32,19.21)
  Top Layer w0.508: v1(44.17,26.16) 44.2,26.2 R73.2 R72.1 R11.2 44.2,30.39 FBIN.1
  Bottom Layer w0.254: v4(41.32,19.21) 41.32,20.24 42.11,21.03 42.11,22 44.17,24.05 v1(44.17,26.16)
FBOUT: length 21.3
  Top Layer w0.254: U2.9 40.13,19.8 v4(40.16,19.83)
  Top Layer w0.508: R71.1 49.44,32.31 FBO.1 48.15,32.42 R5.2 47.25,32.36 R6.1
  Bottom Layer w0.254: v1(47.24,31.7) 45.82,31.7 42.82,28.7 42.82,25.35 40.16,22.68 v4(40.16,19.83)
FBOUT_DAC: length 23.6
  Top Layer w0.254: v4(70.64,28.13) 71.69,28.13 72.45,27.38 U16.10
  Inner2 w0.254: v1(52.3,31.44) 53.06,32.21 66.56,32.21 v4(70.64,28.13)
GATEINTVCC: length 33.8
  Top Layer w0.254: U2.35 36.33,14.48 v1(36.08,14.22) 36.11,14.22 36.96,13.37 36.96,12.43 C27.2 ; C26.2 37.83,25.94 U2.17
  Top Layer w0.508: C26.2 31.64,32.13 GVCC.1 ; R31.1 30.61,32.13
  Bottom Layer w0.254: v1(36.08,14.22) 35.31,14.22 35.05,14.48 35.05,24.64 36.58,26.16 v1(38.38,26.16)
ILOADNMCU: length 4.7
  Top Layer w0.254: U16.15 67.27,23.77 C104.2
  Top Layer w0.508: 65.4,23.62 66.99,23.62 67.06,23.68
ILOADPMCU: length 9.5
  Top Layer w0.254: U16.16 70.79,23.27 71.02,23.5 71.02,24.01 70.76,24.27 U16.14 67.93,24.27 67.25,24.96 67.06,24.96
  Top Layer w0.508: 67.06,25.08 66.99,25.15 65.4,25.15 65.4,26.6 65.59,26.8
IMONONMCU: length 51.5
  Top Layer w0.254: v4(72.31,15.19) 72.45,15.32 U16.27 ; U2.39 38.33,14.5 38.6,14.23 v4(38.62,14.23)
  Top Layer w0.508: ION.1 40.96,5.97 C22.1 40.84,6.09 R27.1 v1(39.24,6.72)
  Bottom Layer w0.254: v4(72.31,15.19) 63.09,15.19 54.62,6.72 v1(39.24,6.72) 38.62,7.35 v4(38.62,14.23)
IMONOPMCU: length 53.8
  Top Layer w0.254: U16.28 72.95,15.83 v4(73.03,15.75) ; U2.38 37.83,14.36 37.97,14.22 v4(37.97,13.34)
  Top Layer w0.508: IOP.1 35.93,6.1 R28.1 37.54,6.09 C21.1 38,6.44 v1(38,6.57)
  Bottom Layer w0.254: v4(37.97,13.34) 37.97,7.87 38,7.85 v1(38,6.57) 38.5,6.07 54.74,6.07 63.25,14.58 72.69,14.58 73.03,14.91 v4(73.03,15.75)
M4: length 67.2
  Top Layer w0.508: R20.1 27.14,17.45 v1(27.13,17.45)
  Bottom Layer w0.508: v1(27.13,17.45) 26.62,17.45 24.51,19.56 24.51,34.29 36.45,46.23 36.45,54.74 36.96,55.25 36.96,64.77 36.45,65.28 36.45,73.66 37.86,75.07 v1(39.12,75.07)
  vias: v1(25.4,77.09) v1(30.35,73.41) v1(30.35,72.52) v1(30.35,71.63) v1(30.35,70.61) v1(31.24,73.41) v1(31.24,72.52) v1(31.24,71.63) v1(31.24,70.61) v1(32.13,73.41) v1(32.13,72.52) v1(32.13,71.63) v1(32.13,70.61) v1(33.02,73.41) v1(33.02,72.52) v1(33.02,71.63) v1(33.02,70.61) v1(33.91,73.41) v1(33.91,72.52) v1(33.91,71.63) v1(33.91,70.61) v2(22.83,75.03) v2(22.83,74.02) v2(22.83,73) v2(22.83,71.99) v2(22.83,70.97) v2(23.85,75.03) v2(23.85,74.02) v2(23.85,73) v2(23.85,71.99) v2(23.85,70.97) v2(24.87,75.03) v2(24.87,74.02) v2(24.87,73) v2(24.87,71.99) v2(24.87,70.97) v2(25.88,75.03) v2(25.88,74.02) v2(25.88,73) v2(25.88,71.99) v2(25.88,70.97) v2(26.9,75.03) v2(26.9,74.02) v2(26.9,73) v2(26.9,71.99) v2(26.9,70.97) v2(27.9,75.03) v2(27.9,74.02) v2(27.9,73) v2(27.9,71.99) v2(27.9,70.97)
MCSN: length 78.4
  Top Layer w0.508: 41.29,56.03 41.29,63.6 ; R15.1 45.85,16.76 v1(46.23,17.14) ; 41.57,59.69 41.57,56.29 41.72,56.13 43.24,56.13 43.4,56.29 43.4,63.5 43.35,63.55 41.57,63.55 41.57,63.55 41.57,59.87
  Bottom Layer w0.254: v1(41.6,59.82) 41.15,59.36 41.15,58.04 42.42,56.77 47.37,56.77 50.16,53.97 50.16,19.56 47.88,17.27 46.36,17.27 v1(46.23,17.14)
MCSP: length 51.9
  Top Layer w0.508: v1(46.23,17.91) 45.85,18.29 R14.1
  Bottom Layer w0.254: v1(46.23,17.91) 46.41,17.72 47.63,17.72 49.66,19.75 49.66,53.72 47.12,56.26 42.16,56.26 40.64,57.78 40.64,59.35 v1(40.17,59.82)
MODE: length 56.8
  Top Layer w0.254: U2.37 37.33,14.62 37.44,14.51 v4(37.44,13.96)
  Top Layer w0.508: v1(82.64,23.88) R89.1 R80.2 84.57,25.4 R79.2 84.71,25.02 MODE.1
  Inner2 w0.254: v1(82.64,23.88) 78.2,19.43 74.93,19.43 70.74,15.24 55.57,15.24 52.65,12.32 39.75,12.32 38.11,13.96 v4(37.44,13.96)
MODELSBMCU: length 5.2
  Top Layer w0.254: U16.43 79.67,22.27 80.39,22.99 80.39,24.12 R80.1
MODEMSBMCU: length 4.3
  Top Layer w0.254: R89.2 80.9,23.11 80.9,22.75 79.92,21.77 U16.42
PA8-I2C2_SDA: length 21.8
  Top Layer w0.254: U16.30 73.95,15.78 69.98,11.81 62.98,11.81 R48.2 ; D11.2 62.33,5.16 U13.3
  Top Layer w0.508: 62.33,9.3 62.33,11.01 62.23,11.11
PA9-I2C2_SCL: length 20.9
  Top Layer w0.254: D11.1 63.63,5.11 U13.4 ; R49.2 69.99,11.06 74.45,15.52 U16.31
  Top Layer w0.508: 63.75,11.11 63.75,9.42 63.63,9.3
PB8-FDCAN1_RX: length 28.3
  Top Layer w0.254: U16.45 77.5,23.27 v5(77.22,22.99)
  Top Layer w0.508: U10.4 v1(81.03,10.79)
  Inner2 w0.254: v1(81.03,10.79) 79.5,12.32 79.5,16 84.96,21.46 84.96,24.64 84.2,25.4 79.63,25.4 v5(77.22,22.99)
PB9-FDCAN1_TX: length 26.4
  Top Layer w0.254: v5(77.14,23.7) 77.21,23.77 U16.46
  Top Layer w0.508: U10.1 v1(84.84,10.79)
  Inner2 w0.254: v1(84.84,10.79) 84.81,10.82 84.81,19.79 85.47,20.45 85.47,24.77 84.33,25.91 79.35,25.91 v5(77.14,23.7)
PB10-USART3_TX: length 30
  Top Layer w0.254: U16.22 v1(71.19,20.27)
  Top Layer w0.508: D12.2 87.59,35.27 88.88,33.99 88.88,31.75 88.37,31.24 U14.2
  Inner2 w0.254: v1(71.19,20.27) 72.64,21.72 72.64,22.86 76.71,26.92 85.34,26.92 86.47,28.05 v1(86.47,31.24)
PB11-USART3_RX: length 29
  Top Layer w0.254: U16.25 v1(71.02,17.77)
  Top Layer w0.508: U14.3 86.91,33.01 D12.1
  Inner2 w0.254: v1(71.02,17.77) 71.02,19.08 73.15,21.21 73.15,22.61 76.96,26.42 85.6,26.42 87.12,27.94 87.12,32.19 86.8,32.51 v1(86.49,32.51)
RVSOFFMCU: length 59
  Top Layer w0.254: v1(77.22,20.85) 77.3,20.77 U16.40 ; R24.2 31.88,20.69 v1(32.27,20.69) 33.79,20.69 33.93,20.55 U2.25
  Inner2 w0.254: v1(77.22,20.85) 75.08,20.85 70.49,16.26 55.07,16.26 53.03,14.22 47.7,14.22 47.45,13.97 44.04,13.97 40.69,17.32 40.03,17.32 38.1,15.39 35.41,15.39 34.85,15.95 34.85,20.29 34.57,20.57 33.88,20.57 33.76,20.69 v1(32.27,20.69)
SHDN: length 21.5
  Top Layer w0.254: v1(40.39,16.72) 40.3,16.8 U2.3
  Top Layer w0.508: SHDN.1 24.88,9.41 R22.1 R21.2 25.78,12.06 v1(26.03,11.81)
  Inner2 w0.254: v1(26.03,11.81) 29.59,11.81 33.02,15.24 34.8,15.24 35.16,14.88 38.55,14.88 v1(40.39,16.72)
SW1: length 39.4
  Top Layer w0.254: C28.1 32.96,23.69 34.34,22.3 U2.22
  Top Layer w0.508: v1(31.75,25.08) C28.1 30.26,25.17 D6.2 ; v1(36.07,38.73) v1(36.07,31.75)
  Inner1 w0.508: v1(36.07,38.73) 36.07,39.41 35.28,40.2 35.28,49.91 34.7,50.49 34.7,50.65 33.91,51.44 ; v1(36.07,31.75) 36.07,32 35.6,32.47 34.88,32.47 34.29,31.88 34.29,25.65 33.72,25.08 v1(31.75,25.08)
  vias: v1(30.35,56.64) v1(30.35,55.75) v1(30.35,54.86) v1(30.35,53.85) v1(31.24,56.64) v1(31.24,55.75) v1(31.24,54.86) v1(31.24,53.85) v1(32.13,56.64) v1(32.13,55.75) v1(32.13,54.86) v1(32.13,53.85) v1(33.02,56.64) v1(33.02,55.75) v1(33.02,54.86) v1(33.02,53.85) v1(33.91,56.64) v1(33.91,55.75) v1(33.91,54.86) v1(33.91,53.85) v2(22.61,58.93) v2(22.61,57.91) v2(22.61,51.44) v2(22.61,50.42) v2(23.63,58.93) v2(23.63,57.91) v2(23.63,51.44) v2(23.63,50.42) v2(24.64,58.93) v2(24.64,57.91) v2(24.64,51.44) v2(24.64,50.42) v2(25.66,58.93) v2(25.66,57.91) v2(25.66,51.44) v2(25.66,50.42) v2(26.68,58.93) v2(26.68,57.91) v2(26.68,51.44) v2(26.68,50.42) v2(27.68,58.93) v2(27.68,57.91) v2(27.68,51.44) v2(27.68,50.42)
SW2: length 54.7
  Top Layer w0.254: 34.22,25.91 34.22,24.45 35.33,23.34 U2.21
  Top Layer w0.508: 34.22,25.91 33.15,25.91 31.25,27.8 v1(31.04,27.8) D7.2 ; v1(39.24,38.73) 39.24,39.12 38.86,39.5 34.8,39.5 34.29,38.99 34.29,32.46 v1(33.58,31.75)
  Inner1 w0.508: 34.16,63.5 34.16,62.6 36.04,60.72 36.04,58.04 36.55,57.53 36.55,51.23 37.11,50.67 37.11,40.96 39.09,38.98 39.09,38.89 v1(39.24,38.73) ; v1(31.04,27.8) 32.88,27.8 33.58,28.5 v1(33.58,31.75)
  vias: v1(30.35,65.79) v1(30.35,64.9) v1(30.35,64.01) v1(30.35,62.99) v1(31.24,65.79) v1(31.24,64.9) v1(31.24,64.01) v1(31.24,62.99) v1(32.13,65.79) v1(32.13,64.9) v1(32.13,64.01) v1(32.13,62.99) v1(33.02,65.79) v1(33.02,64.9) v1(33.02,64.01) v1(33.02,62.99) v1(33.91,65.79) v1(33.91,64.9) v1(33.91,64.01) v1(33.91,62.99) v2(22.6,61.76) v2(22.6,60.74) v2(22.87,69.22) v2(22.87,68.2) v2(23.62,61.76) v2(23.62,60.74) v2(23.88,69.22) v2(23.88,68.2) v2(24.63,61.76) v2(24.63,60.74) v2(24.9,69.22) v2(24.9,68.2) v2(25.65,61.76) v2(25.65,60.74) v2(25.91,69.22) v2(25.91,68.2) v2(26.66,61.76) v2(26.66,60.74) v2(26.93,69.22) v2(26.93,68.2) v2(27.67,61.76) v2(27.67,60.74) v2(27.93,69.22) v2(27.93,68.2)
SWCLK: length 14.4
  Top Layer w0.254: U16.38 79.84,19.77 80.14,20.07 86.06,20.07 86.46,20.46 CN3.2 87.38,20.46 88.02,19.82 88.02,18.42 87.64,18.04 87.64,16.9 87.24,16.5 86.56,16.5
SWDIO: length 10.1
  Top Layer w0.254: U16.37 79.97,19.27 80.26,19.56 86.1,19.56 86.46,19.21 CN3.1
  Top Layer w0.508: 86.56,17.8 86.81,18.06 CN3.1
SWEN: length 53.3
  Top Layer w0.254: v4(36.86,14.35) 36.83,14.38 U2.36
  Top Layer w0.508: EN1.1 84.17,20.83 R26.2 v1(82.65,20.83)
  Inner2 w0.254: v1(82.65,20.83) 80.74,18.92 75.06,18.92 70.87,14.73 55.78,14.73 52.86,11.81 38.74,11.81 36.83,13.72 36.83,14.32 v4(36.86,14.35)
SWENMCU: length 4.9
  Top Layer w0.254: R26.1 80.4,20.83 79.96,21.27 U16.41
  Top Layer w0.508: R26.1 R25.2
TG1: length 15.2
  Top Layer w0.254: v1(33.66,21.97) 33.83,21.8 U2.23
  Top Layer w0.508: v1(35.18,31.7) TG1.1 R7.2
  Inner1 w0.508: v1(33.66,21.97) 33.66,23.11 35.18,24.64 v1(35.18,31.7)
TG2: length 16.4
  Top Layer w0.254: U2.20 35.83,23.92 v1(35.75,24)
  Top Layer w0.508: R10.2 TG2.1 v1(40,31.7)
  Inner1 w0.508: v1(35.75,24) 36.32,24.58 36.32,29.46 37.72,30.86 37.72,31.94 38.19,32.41 38.78,32.41 39.48,31.7 v1(40,31.7)
VAUXIN: length 39
  Top Layer w0.254: 1.78,22.7 1.52,22.7
  Top Layer w1.27: D14.2 D13.2 3.63,30.69 1.78,28.83 1.78,6.1 4.42,3.46 C96.2
VCAPMCU: length 29.5
  Top Layer w0.254: v4(73.6,25.03) 73.45,25.19 U16.8
  Top Layer w0.508: R88.2 R86.1 51.83,35.52 VCAP.1
  Bottom Layer w0.254: v4(73.6,25.03) 73.6,27.02 67.68,32.94 v1(52.46,32.94)
$1N2584: length 27
  Top Layer w0.508: R8.1 v1(36.96,38.72)
  Inner1 w0.508: v1(36.96,38.72) 36.96,39.38 35.89,40.45 35.89,50.16 35.31,50.75 35.31,57.02 34.67,57.66 30.49,57.66 v1(29.68,58.47)
$1N2588: length 25.9
  Top Layer w0.508: v1(38.34,38.72) 38.48,38.58 R9.1
  Inner1 w0.508: v1(38.34,38.72) 38.34,38.87 36.5,40.7 36.5,50.42 35.94,50.97 35.94,57.28 35.43,57.78 35.43,60.33 v1(34.54,61.21)
$1N2593: length 34.1
  Top Layer w0.508: R10.1 v1(40,38.72)
  Inner1 w0.508: v1(34.54,68.83) 35.56,67.82 35.56,62.07 36.65,60.97 36.65,58.29 37.19,57.76 37.19,51.46 37.72,50.92 37.72,41.53 40,39.24 v1(40,38.72)
$1N2600: length 18.5
  Top Layer w0.508: R7.1 v1(35.18,38.72)
  Inner1 w0.508: v1(35.18,38.72) 34.67,39.23 34.67,49.66 34.29,50.04 30.22,50.04 29.68,50.58 v1(29.68,50.83)
$1N21405: length 1.5
  Top Layer w0.254: Q5.6 46.11,25.92 R73.1
$1N21448: length 2.8
  Top Layer w0.254: Q5.3 Q5.2
  Top Layer w0.508: R74.2 48.9,29.17 Q5.3
$2N503: length 2.8
  Top Layer w0.254: U2.13 41.86,21.8 RT.1
$2N2242: length 11.7
  Top Layer w0.254: U2.2 39.96,16.3 40.26,16 v1(40.77,16)
  Top Layer w0.508: C23.1 48.6,13.44 v1(48.01,13.44)
  Inner2 w0.254: v1(40.77,16) 40.77,13.84 41.17,13.44 v1(48.01,13.44)
$2N2570: length 9.9
  Top Layer w0.254: U2.6 41.16,18.3 43.94,21.08 43.94,22.09 R29.1
  Top Layer w0.508: ICN.1 43.93,23.88 R50.1 R29.1
$2N3394: length 11.9
  Top Layer w0.254: 31.75,22.29 32.74,21.3 U2.24
  Top Layer w0.508: 31.75,22.29 31.24,22.29 29.83,23.7 25.07,23.7 24.51,24.26 D2.1
$2N3435: length 10.9
  Top Layer w0.254: C29.2 36.33,25.2 U2.19
  Top Layer w0.508: D1.1 31.5,30.23 35.69,26.03 35.69,25.97 C29.2
$2N3475: length 5.4
  Top Layer w0.508: D2.2 24.51,28.24 D1.2 27.82,31.55 R31.2
$2N4494: length 13.5
  Top Layer w0.254: U2.10 39.88,20.3 39.94,20.36 40.37,20.36 40.54,20.19 42.15,20.19 v4(42.17,20.17)
  Top Layer w0.508: VC.1 48.65,14.99 48.65,15.06 ; 48.65,15.06 R43.1 ; 48.65,15.06 C38.1
  Inner2 w0.254: v4(42.17,20.17) 43.09,19.25 46.57,19.25 v1(48.71,17.12)
$2N4749: length 1.7
  Top Layer w0.508: R43.2 51.75,16.66 C39.1
$2N11449: length 1.7
  Top Layer w0.508: R50.2 47.36,23.88 47.37,23.86
$2N11490: length 1.7
  Top Layer w0.508: C53.1 24.84,15.18 R51.2
$2N11498: length 14.2
  Top Layer w0.254: U2.28 v1(34.04,19.05)
  Top Layer w0.508: v1(25.84,15.24) R51.1 ; R51.1 R30.1 ; R51.1 26.42,15.25 ICP.1
  Inner2 w0.254: v1(25.84,15.24) 26.96,16.36 32.41,16.36 34.04,17.98 v1(34.04,19.05)
$2N14127: length 19.3
  Top Layer w0.254: v4(40.96,20.77) 40.94,20.8 U2.11
  Top Layer w0.508: 50.31,20.59 50.31,21.15 50.3,21.16 R84.1 50.35,22.2 ; 50.31,20.59 50.31,18.93 ; 50.31,20.59 C98.1 ; R81.2 50.31,18.93 ; 50.31,18.93 IINP.1 ; 50.35,22.7 50.35,22.2 ; 50.35,22.2 C98.1 ; v1(50.89,20.55) C98.1
  Inner2 w0.254: v4(40.96,20.77) 41.16,20.57 41.71,20.57 42.57,21.44 50,21.44 v1(50.89,20.55)
$2N14132: length 19
  Top Layer w0.254: v4(41.53,21.27) 41.5,21.3 U2.12
  Top Layer w0.508: 50.3,25.33 C97.1 50.35,26.68 ; 50.3,25.33 R82.2 ; 50.3,25.33 50.3,26.63 ; 50.3,26.63 R83.2 50.35,26.82 50.35,26.68 ; 50.3,26.63 50.35,26.68 ; v1(50.86,23.67) R82.2 ; R82.2 IINN.1
  Inner2 w0.254: v1(50.86,23.67) 43.93,23.67 v4(41.53,21.27)
$3N12365: length 2
  Top Layer w0.508: U23.1 10.34,9.81 C79.2
$3N12409: length 3.5
  Top Layer w0.508: R64.2 R63.1 6.92,9.94 U23.3
$3N12423: length 2
  Top Layer w0.508: U23.4 6.92,7.39 R61.1
$3N14012: length 2
  Top Layer w0.508: U24.1 10.34,25.12 C88.2
$3N14023: length 3.5
  Top Layer w0.508: U24.3 6.92,25.25 R68.1 R67.2
$3N14026: length 2
  Top Layer w0.508: R65.1 6.92,22.7 U24.4
$3N18397: length 5.8
  Top Layer w0.508: U25.1 58.42,32.26 58.86,32.7 C106.1 58.86,36.4 R93.2
$3N18401: length 5.8
  Top Layer w0.508: U25.8 60.71,32.26 60.26,32.7 60.26,36.4 R94.2
$3N18526: length 4.2
  Top Layer w0.508: U25.5 62.13,26.78 R90.1
$3N18889: length 2.6
  Top Layer w1.27: 7.32,37.34 H1.2
$5N1318: length 12
  Top Layer w0.254: D9.1 75.33,13.73 75.95,14.35 U16.34
  Top Layer w0.305: 74.93,8.82 74.56,8.82 74.41,8.67 USB1.A6 ; 74.93,8.82 75.25,8.82 75.41,8.67 USB1.B6 ; 74.93,8.82 74.93,9.53 75.37,9.97 75.37,12.84 D9.1
$5N1324: length 13.4
  Top Layer w0.254: U16.33 75.45,14.61 74.03,13.19 D9.2
  Top Layer w0.305: USB1.A7 74.91,7.29 74.67,7.04 74.14,7.04 73.91,7.28 USB1.B7 73.91,8.88 74.48,9.46 74.48,9.54 73.93,10.1 73.93,12.79 D9.2
$5N1336: length 1.9
  Top Layer w0.254: R54.2 73.41,9.49 USB1.A5
$5N1339: length 1.9
  Top Layer w0.254: USB1.B5 76.41,9.68 76.32,9.77
$5N1407: length 34
  Top Layer w0.254: 73.03,6.48 73.03,6.63 72.44,7.21 72.44,7.37 72.26,7.55 USB1.A4B9 ; USB1.B4A9 76.91,7.79 76.91,7.21 76.3,6.6 76.3,6.48
  Top Layer w0.508: 73.03,6.48 73.18,6.33 74.71,6.33 ; v1(50.75,2.79) 50.59,2.79 D8.1 ; v1(74.66,5.97) 74.71,6.02 74.71,6.33 ; 74.71,6.33 76.15,6.33 76.3,6.48
  Inner2 w0.508: v1(50.75,2.79) 53.86,5.9 74.59,5.9 v1(74.66,5.97)
$5N1904: length 8.7
  Top Layer w0.254: U16.6 74.45,27.28 73.15,28.58 73.15,30.55 X1.1 72.2,31.5 C56.1
$5N1911: length 8.6
  Top Layer w0.254: U16.5 74.95,27.32 75.95,28.32 75.95,30.16 X1.3 76.65,31.15 C57.2
$5N3772: length 2.8
  Top Layer w0.508: R57.1 LED3.1
$5N4520: length 12.8
  Top Layer w0.254: U16.2 76.45,26.28 76.45,27.07 76.71,27.33 80.16,27.33 80.52,27.69 80.52,34.04 80.9,34.42 R92.2
$5N4527: length 5.8
  Top Layer w0.508: R92.1 83.5,34.1 SW1.4 83.5,28.76
$5N4702: length 12.2
  Top Layer w0.254: U16.32 74.95,15.26 68.07,8.38 R57.2
$5N5349: length 1.5
  Top Layer w0.508: LED4.2 R58.1
$5N7806: length 15.7
  Top Layer w0.254: 67.62,28.76 71.82,28.76 73.15,27.43 73.53,27.43 73.95,27.02 U16.7
  Top Layer w0.508: 67.62,28.76 SW2.4 67.62,34.73 R75.1 67.43,36.52 C58.2
$5N9867: length 2.4
  Top Layer w0.254: TIM2.1 70.61,27.1 70.86,27.35 71.71,27.35 71.95,27.11 U16.11
$5N9964: length 1.4
  Top Layer w0.254: U16.18 69,22.27 PB2.1
$5N9985: length 1.8
  Top Layer w0.254: PB12.1 71.95,16.57 U16.26

## Copper pours and planes (outline as drawn; the poured copper is in the pictures)
7V8 on Top Layer: 9.85,30.32 16.89,30.32 16.89,25.3 9.85,25.3
+5V on Top Layer: 9.81,14.98 16.85,14.98 16.85,9.97 9.81,9.97
AGND on Top Layer: 21.61,39.31 21.61,-0.06 92.73,-0.06 92.73,39.31
AGND on Top Layer: 35.56,21.97 38.61,21.97 38.61,16.13 35.56,16.13
AGND on Top Layer: 35.56,21.97 38.61,21.97 38.61,16.13 35.56,16.13
AGND on Bottom Layer: 21.61,35.63 21.61,-0.04 94.97,-0.04 94.97,39.33 46.15,39.33 46.19,35.63
AGND on Inner1: 21.61,35.71 21.61,-0.09 95.1,-0.09 95.1,39.28 46.15,39.28 46.18,35.71
AGND on Inner2: 21.61,35.63 21.61,-0.04 94.34,-0.04 94.34,39.33 46.15,39.33 46.18,35.63
GND on Top Layer: 0.25,41.02 21.46,41.02 21.46,0.25 0.25,0.25
GND on Top Layer: 35.18,72.26 93.47,72.26 93.47,49.91 35.18,49.91
GND on Bottom Layer: -5.08,82.04 96.27,82.04 96.27,-7.49 -5.08,-7.49
GND on Inner1: -0.38,80.39 92.46,80.39 92.46,0.38 -0.38,0.38
GND on Inner2: -4.7,82.8 99.57,82.8 99.57,-3.94 -4.7,-3.94
GND on Inner2: 54.23,66.37 58.8,66.37 58.8,61.79 54.23,61.79
GND on Inner2: 37.97,69.85 49.78,69.85 49.78,67.06 37.97,67.06
GND on Inner2: 65.79,57.97 70.36,57.97 70.36,53.39 65.79,53.39
GND on Inner2: 65.79,66.37 70.36,66.37 70.36,61.79 65.79,61.79
GND on Inner2: 54.23,57.97 58.8,57.97 58.8,53.39 54.23,53.39
GND on Inner2: 38.23,52.32 49.78,52.32 49.78,49.78 38.23,49.78
VBUSIN on Top Layer: 94.04,52.62 94.04,39.62 42.61,39.62 42.61,49.66 74.58,49.66 74.58,52.62
VBUSOUT on Top Layer: 74.55,58.55 94.25,58.55 94.25,52.96 74.55,52.96
CSNIN on Top Layer: 0.25,39.56 42.29,39.56 42.29,49.72 0.25,49.72
CSNIN on Bottom Layer: 0.22,41.91 30.14,41.91 34.95,46.72 34.95,49.66 0.22,49.66
CSNIN on Inner1: 0.16,41.91 30.33,41.91 34.89,46.47 34.89,49.66 0.16,49.66
CSNIN on Inner2: 0.29,41.85 30.2,41.85 35.02,46.66 35.02,49.72 0.29,49.72
CSNOUT on Top Layer: 35.56,69.85 73.53,69.85 76.17,72.52 93.09,72.52 93.09,79.76 35.56,79.76
M4 on Top Layer: 42.67,69.85 0.25,69.85 0.25,79.38 0.64,79.76 35.31,79.76 35.31,75.31 42.67,75.31
M4 on Top Layer: 21.72,76.45 28.32,76.45 28.32,69.85 21.72,69.85
M4 on Bottom Layer: 35.31,70.1 0.25,70.1 0.25,79.38 0.64,79.76 35.31,79.76
M4 on Inner1: 35.31,70.1 0.25,70.1 0.25,79.38 0.64,79.76 35.31,79.76
M4 on Inner2: 35.31,70.1 0.25,70.1 0.25,79.38 0.64,79.76 35.31,79.76
MCSP on Top Layer: 40.77,63.37 40.77,56.26 35.18,56.26 35.18,57.87 29.34,57.87 29.34,61.85 35.18,61.85 35.18,63.37
SW1 on Top Layer: 29.83,57.14 34.43,57.14 34.43,53.35 29.83,53.35
SW1 on Top Layer: 0.19,59.69 34.93,59.69 34.93,49.91 0.19,49.91
SW1 on Bottom Layer: 0.16,59.75 34.89,59.75 34.89,49.97 0.16,49.97
